# EAGLE design HIVE_dev_sc (EAGLE 9.5.1)

## Sheet 1 of 3
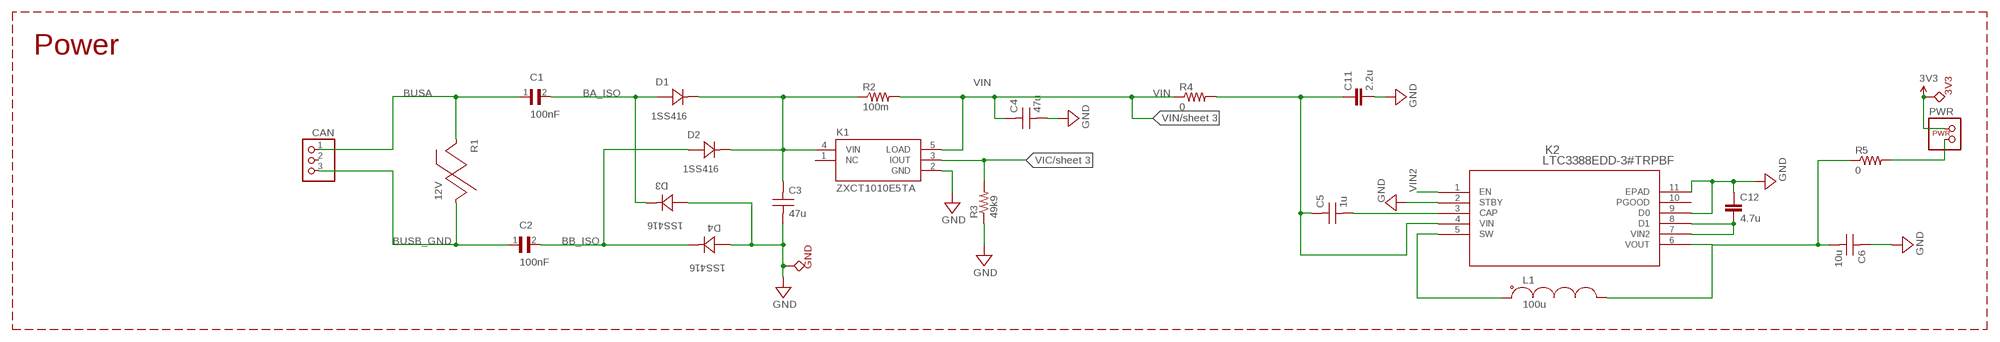
[diagram p0: schematic, sheet 1]

### Parts
3V3  TPTP5001  [TP5000OR5001]
C1  100nF  UMK105BJ104KV-F  [CAPC1005X55N]
C2  100nF  UMK105BJ104KV-F  [CAPC1005X55N]
C3  47u  C_NPOL_0603  [C0603]
C4  47u  C_NPOL_0603  [C0603]
C5  1u  C_NPOL_0201  [C0201]
C6  10u  C_NPOL_0603  [C0603]
C11  2.2u  C_2.2UF_25V_20%_0402  [0402]
C12  4.7u  C_4.7UF_6.3V_20%_0402  [0402]
CAN  PINHD-1X3  [1X03]
D1  1SS416  [SOD-923_TOS]
D2  1SS416  [SOD-923_TOS]
D3  1SS416  [SOD-923_TOS]
D4  1SS416  [SOD-923_TOS]
GND  TPTP5001  [TP5000OR5001]
K1  ZXCT1010E5TA  [SOT25]
K2  LTC3388EDD-3#TRPBF  [DFN-10_DD]
L1  100u  INDUCTOR_LPS4414  [LPS4414]
PWR  POWERJUMP  [1X04]
R1  12V  CG0603MLC  [CG0603MLC]
R2  100m  R_0201  [R0201]
R3  49k9  R_49.9K_1/20W_1%_0201  [0201]
R4  0  R_0201  [R0201]
R5  0  R_0201  [R0201]

### Nets
3V3: 3V3.P$1 PWR.1 PWR.2 ; also sheet 2,3
BA_ISO: C1.2 D1.2(ANODE) D3.1(CATHODE)
BB_ISO: C2.2 D2.2(ANODE) D4.1(CATHODE)
BUSA: C1.1 CAN.1 R1.1 ; also sheet 2
BUSB_GND: C2.1 CAN.3 R1.2 ; also sheet 2
GND: C3.1 C4.1 C6.2 C11.2 C12.1 D3.2(ANODE) D4.2(ANODE) GND.P$1 K1.2(GND) K2.2(STBY) K2.9(D0) K2.11(EPAD) R3.1 ; also sheet 2,3
N$1: C5.2 C11.1 K2.4(VIN) R4.2
N$4: C12.2 K2.7(VIN2) K2.8(D1)
N$5: C6.1 K2.6(VOUT) L1.P$2 R5.1
N$6: C5.1 K2.3(CAP)
N$7: C3.2 D1.1(CATHODE) D2.1(CATHODE) K1.4(VIN) R2.1
N$8: K2.5(SW) L1.P$1
N$46: PWR.3 PWR.4 R5.2
VIC: K1.3(IOUT) R3.2 ; also sheet 3
VIN: C4.2 K1.5(LOAD) R2.2 R4.1 ; also sheet 3
VIN2: K2.1(EN) ; also sheet 2
Unconnected: CAN.2 K1.1(NC) K2.10(PGOOD)

### Notes on the sheet
- Power

## Sheet 2 of 3
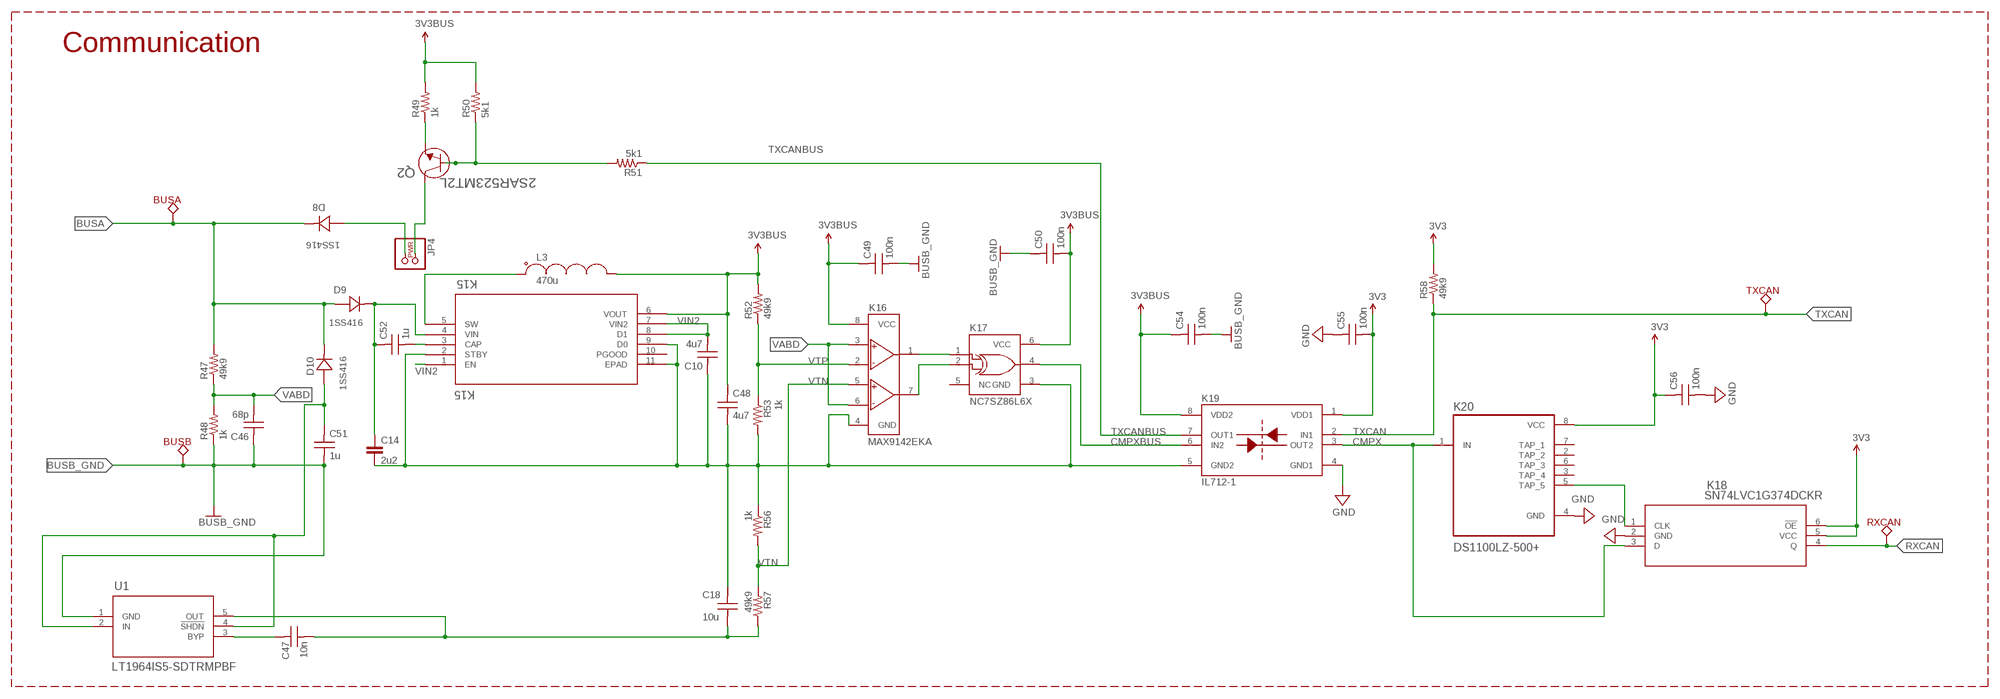
[diagram p1: schematic, sheet 2]

### Parts
BUSA  TPTP5001  [TP5000OR5001]
BUSB  TPTP5001  [TP5000OR5001]
C10  4u7  C_NPOL_0402  [C0402]
C14  2u2  C_2.2UF_25V_20%_0402  [0402]
C18  10u  C_NPOL_0201  [C0201]
C46  68p  C_NPOL_0201  [C0201]
C47  10n  C_NPOL_0201  [C0201]
C48  4u7  C_NPOL_0402  [C0402]
C49  100n  C_NPOL_0201  [C0201]
C50  100n  C_NPOL_0201  [C0201]
C51  1u  C_NPOL_0201  [C0201]
C52  1u  C_NPOL_0201  [C0201]
C54  100n  C_NPOL_0201  [C0201]
C55  100n  C_NPOL_0201  [C0201]
C56  100n  C_NPOL_0201  [C0201]
D8  1SS416  [SOD-923_TOS]
D9  1SS416  [SOD-923_TOS]
D10  1SS416  [SOD-923_TOS]
JP4  POWERJUMP  [1X04]
K15  K15  LTC3388EDD-3#TRPBF  [DFN-10_DD]
K16  MAX9142EKA  [SOT23-8]
K17  NC7SZ86L6X  [MAC06A]
K18  SN74LVC1G374DCKR  [DCK6]
K19  IL712-1  [MSOP-8]
K20  DS1100LZ-500+  [SOIC127P600X175-8N]
L3  470u  INDUCTOR_CB2518  [CB2518]
Q2  2SAR523MT2L  [TRANS_2SAR522M_ROM]
R47  49k9  R_49.9K_1/20W_1%_0201  [0201]
R48  1k  R_1K_1/20W_1%_0201  [0201]
R49  1k  R_1K_1/20W_1%_0201  [0201]
R50  5k1  R_5.1K_1/20W_5%_0201  [0201]
R51  5k1  R_5.1K_1/20W_5%_0201  [0201]
R52  49k9  R_49.9K_1/20W_1%_0201  [0201]
R53  1k  R_1K_1/20W_1%_0201  [0201]
R56  1k  R_1K_1/20W_1%_0201  [0201]
R57  49k9  R_49.9K_1/20W_1%_0201  [0201]
R58  49k9  R_49.9K_1/20W_1%_0201  [0201]
RXCAN  TPTP5001  [TP5000OR5001]
TXCAN  TPTP5001  [TP5000OR5001]
U1  LT1964IS5-SDTRMPBF  [TSOT23-5_S5_ADI]

### Nets
3V3: C55.1 C56.2 K18.5(VCC) K18.6(!OE) K19.1(VDD1) K20.8(VCC) R58.2 ; also sheet 1,3
3V3BUS: C48.2 C49.2 C50.1 C54.2 K15.6(VOUT) K16.8(VCC) K17.6(VCC) K19.8(VDD2) L3.2 R49.2 R50.2 R52.2
3V3BUS2: JP4.1 JP4.2 Q2.1(COLLECTOR)
BUSA: BUSA.P$1 D8.1(CATHODE) D9.2(ANODE) D10.1(CATHODE) R47.2 ; also sheet 1
BUSB_GND: BUSB.P$1 C46.2 C49.1 C50.2 C51.1 C54.1 R48.1 U1.1(GND) ; also sheet 1
CMPX: K18.3(D) K19.3(OUT2) K20.1(IN)
CMPXBUS: K17.4(Y) K19.6(IN2)
GND: C55.2 C56.1 K18.2(GND) K19.4(GND1) K20.4(GND) ; also sheet 1,3
N$9: K15.5(SW) L3.1
N$10: C10.2 C14.2 C18.2 C48.1 K15.2(STBY) K15.9(D0) K15.11(EPAD) K16.4(GND) K17.3(GND) K19.5(GND2) R53.2 R56.1
N$11: C52.1 K15.3(CAP)
N$12: K18.1(CLK) K20.5(TAP_5)
N$13: Q2.3(EMITTER) R49.1
N$90: C47.2 U1.3(BYP)
N$96: C14.1 C52.2 D9.1(CATHODE) K15.4(VIN)
N$128: C51.2 D10.2(ANODE) U1.2(IN) U1.4(!SHDN)
N$138: C18.1 C47.1 R57.1 U1.5(OUT)
N$161: Q2.2(BASE) R50.1 R51.2
N$163: K16.1(OUT1) K17.1(A)
N$164: K16.7(OUT2) K17.2(B)
N$168: D8.2(ANODE) JP4.3 JP4.4
RXCAN: K18.4(Q) RXCAN.P$1 ; also sheet 3
TXCAN: K19.2(IN1) R58.1 TXCAN.P$1 ; also sheet 3
TXCANBUS: K19.7(OUT1) R51.1
VABD: C46.1 K16.3(+IN1) K16.6(-IN2) R47.1 R48.2
VIN2: C10.1 K15.1(EN) K15.7(VIN2) K15.8(D1) ; also sheet 1
VTN: K16.5(+IN2) R56.2 R57.2
VTP: K16.2(-IN1) R52.1 R53.1
Unconnected: K15.10(PGOOD) K17.5(NC) K20.2(TAP_2) K20.3(TAP_4) K20.6(TAP_3) K20.7(TAP_1)

### Notes on the sheet
- Communication

## Sheet 3 of 3
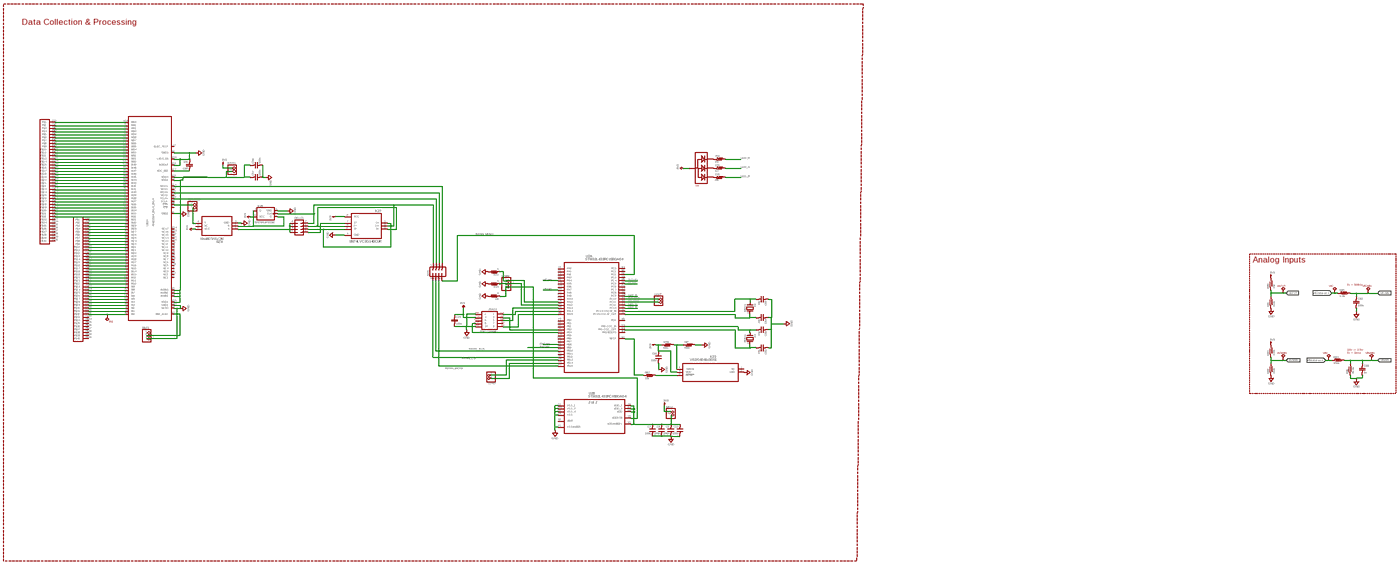
[diagram p2: schematic, sheet 3, overview]
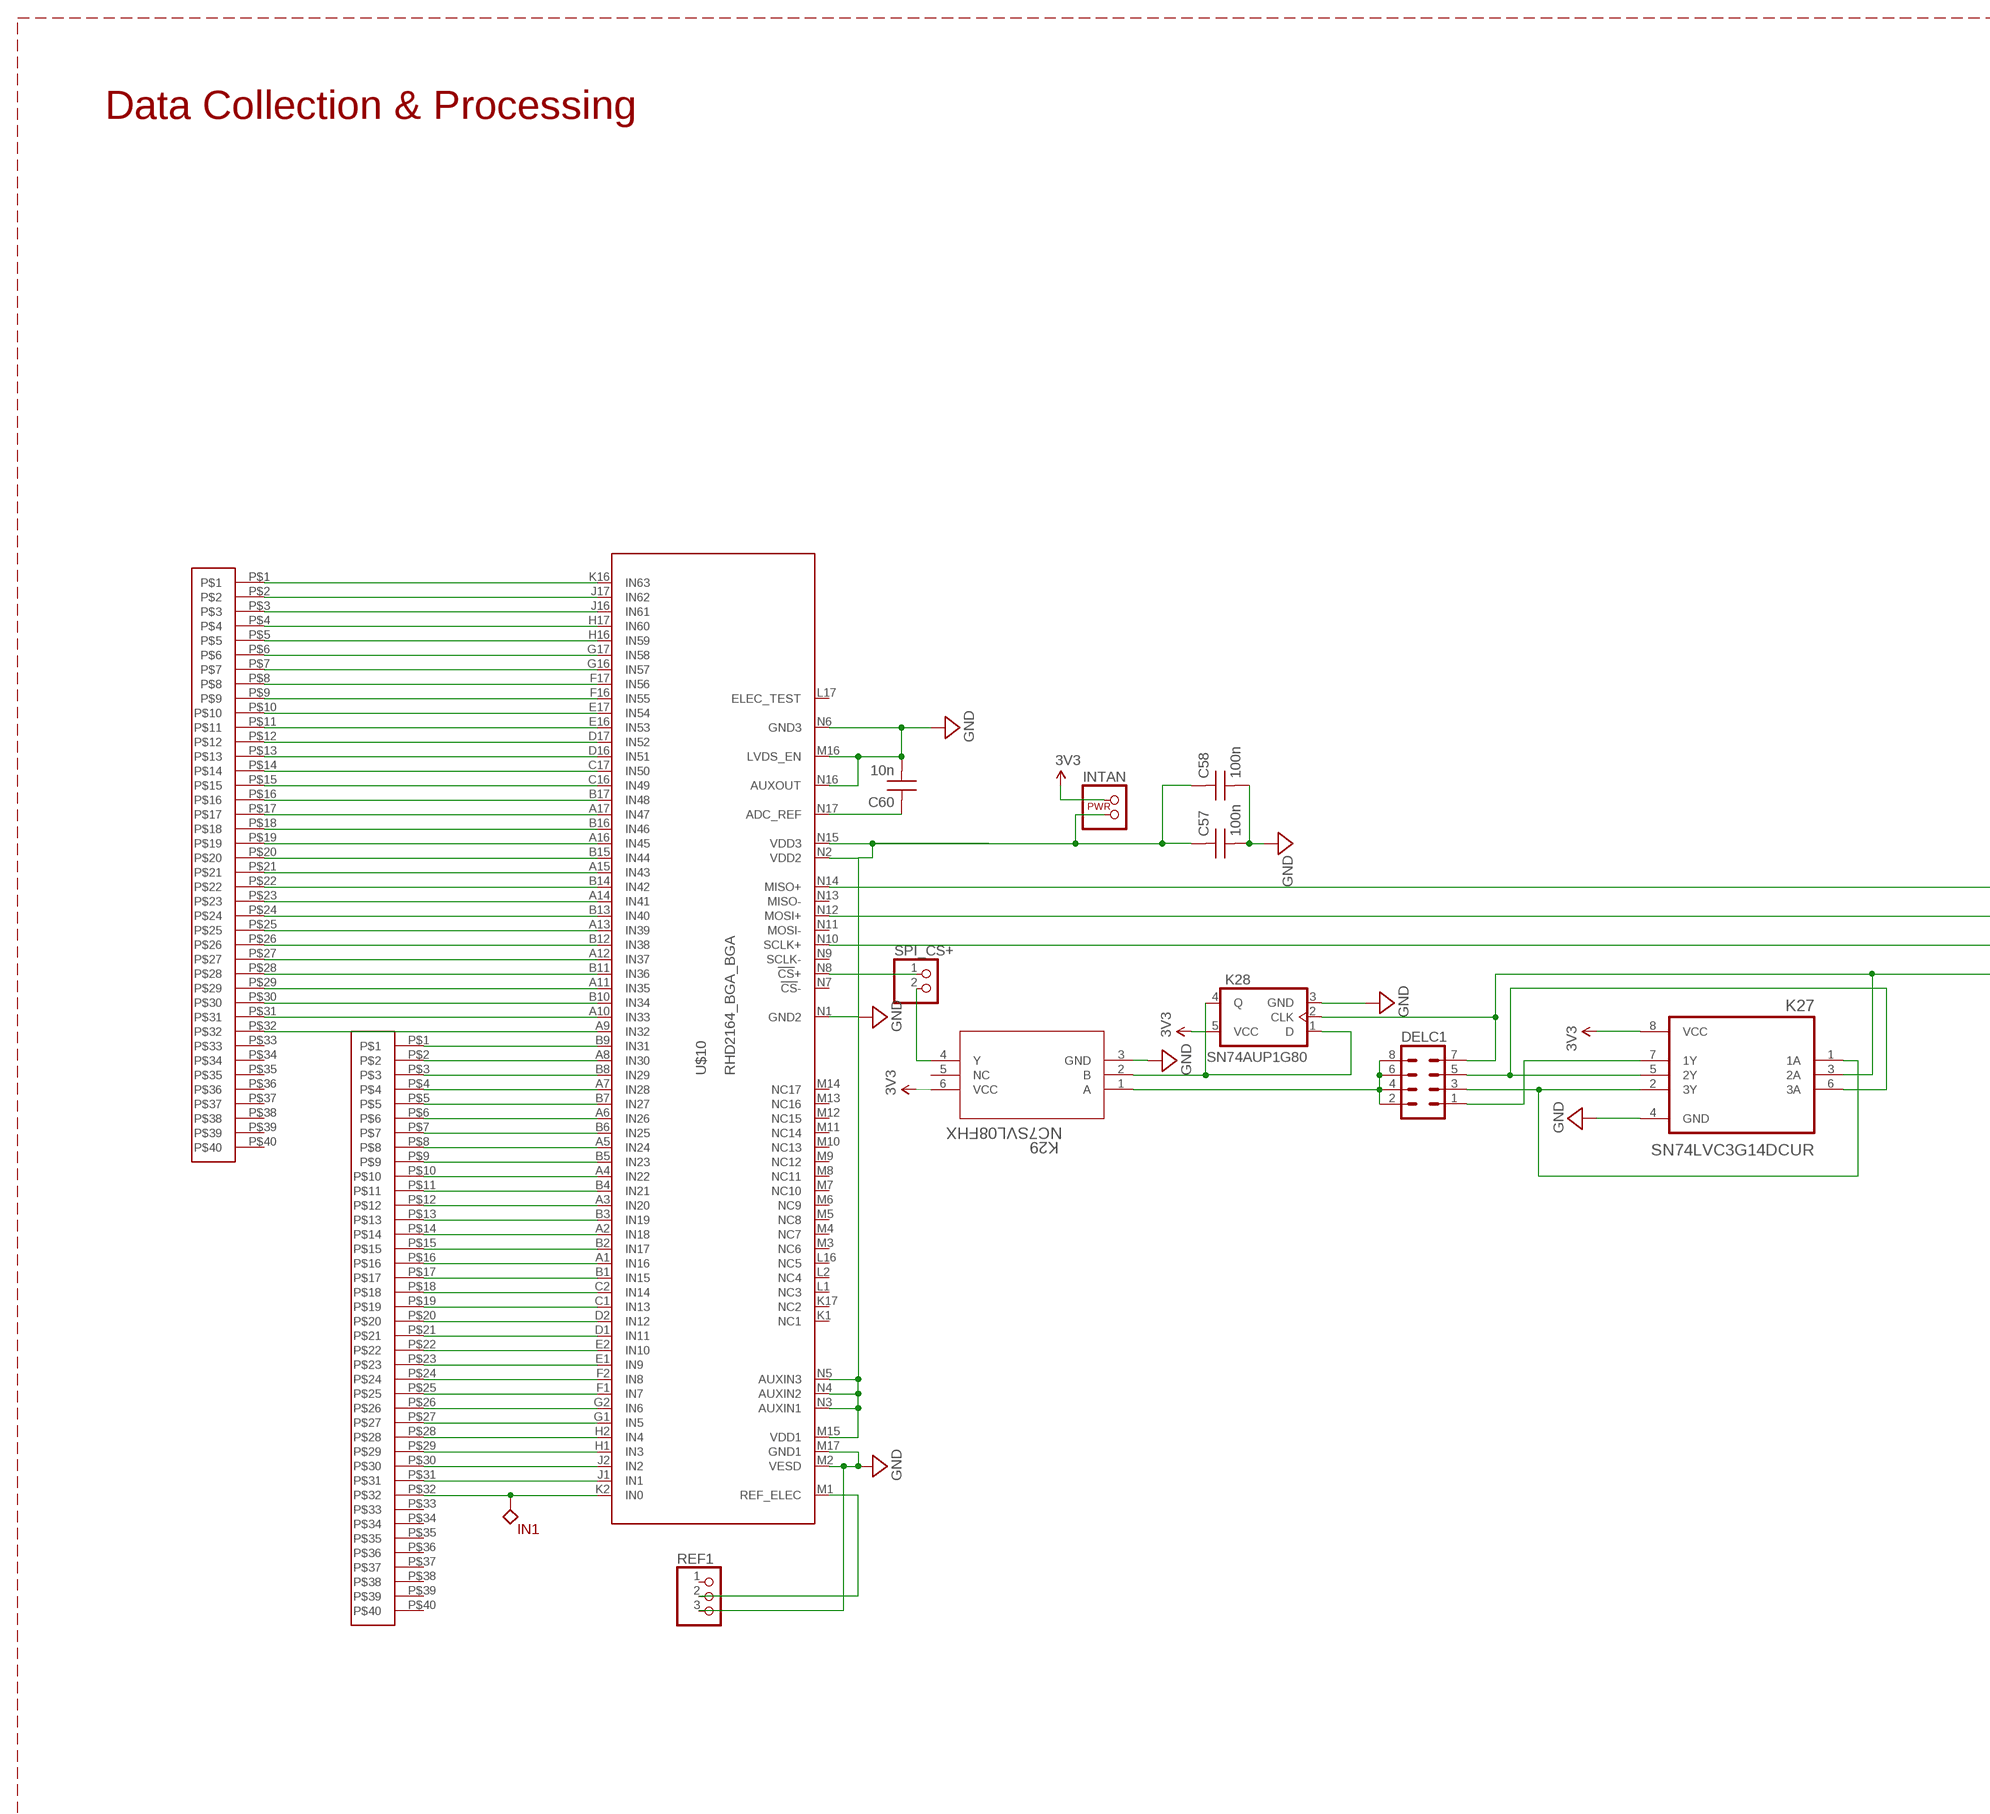
[diagram p3: schematic, sheet 3, part 1 of 5]
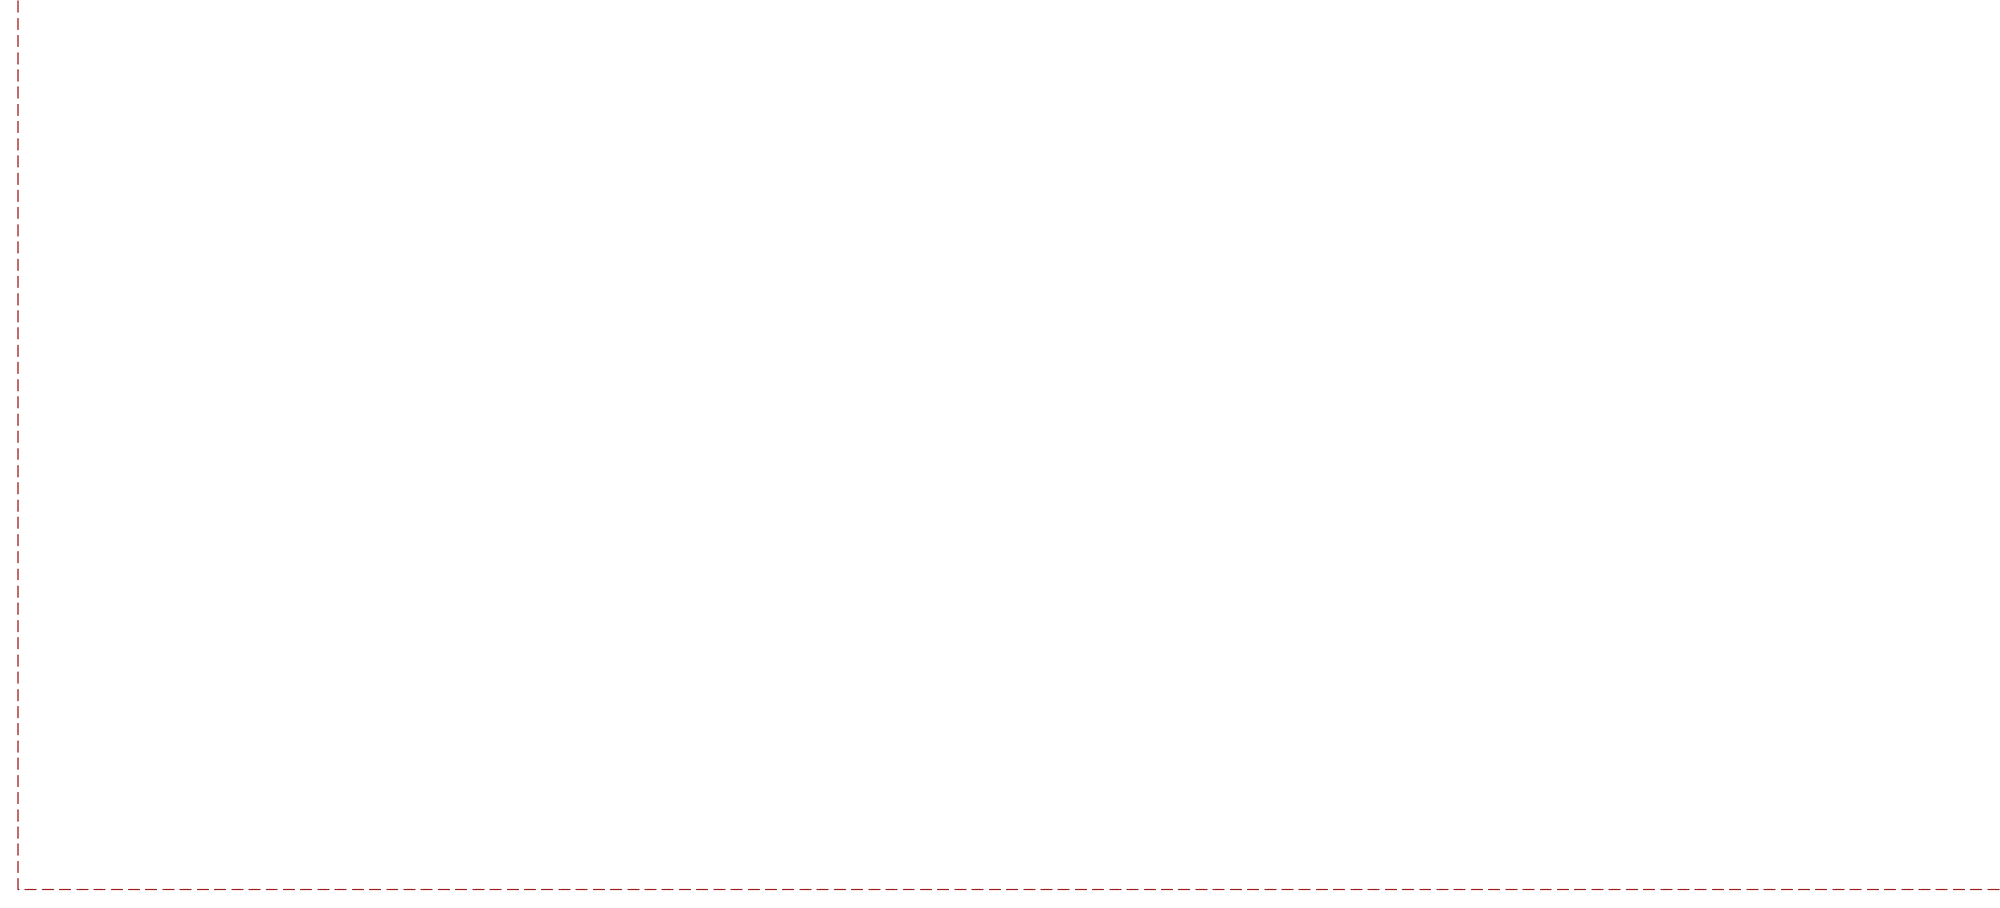
[diagram p4: schematic, sheet 3, part 2 of 5]
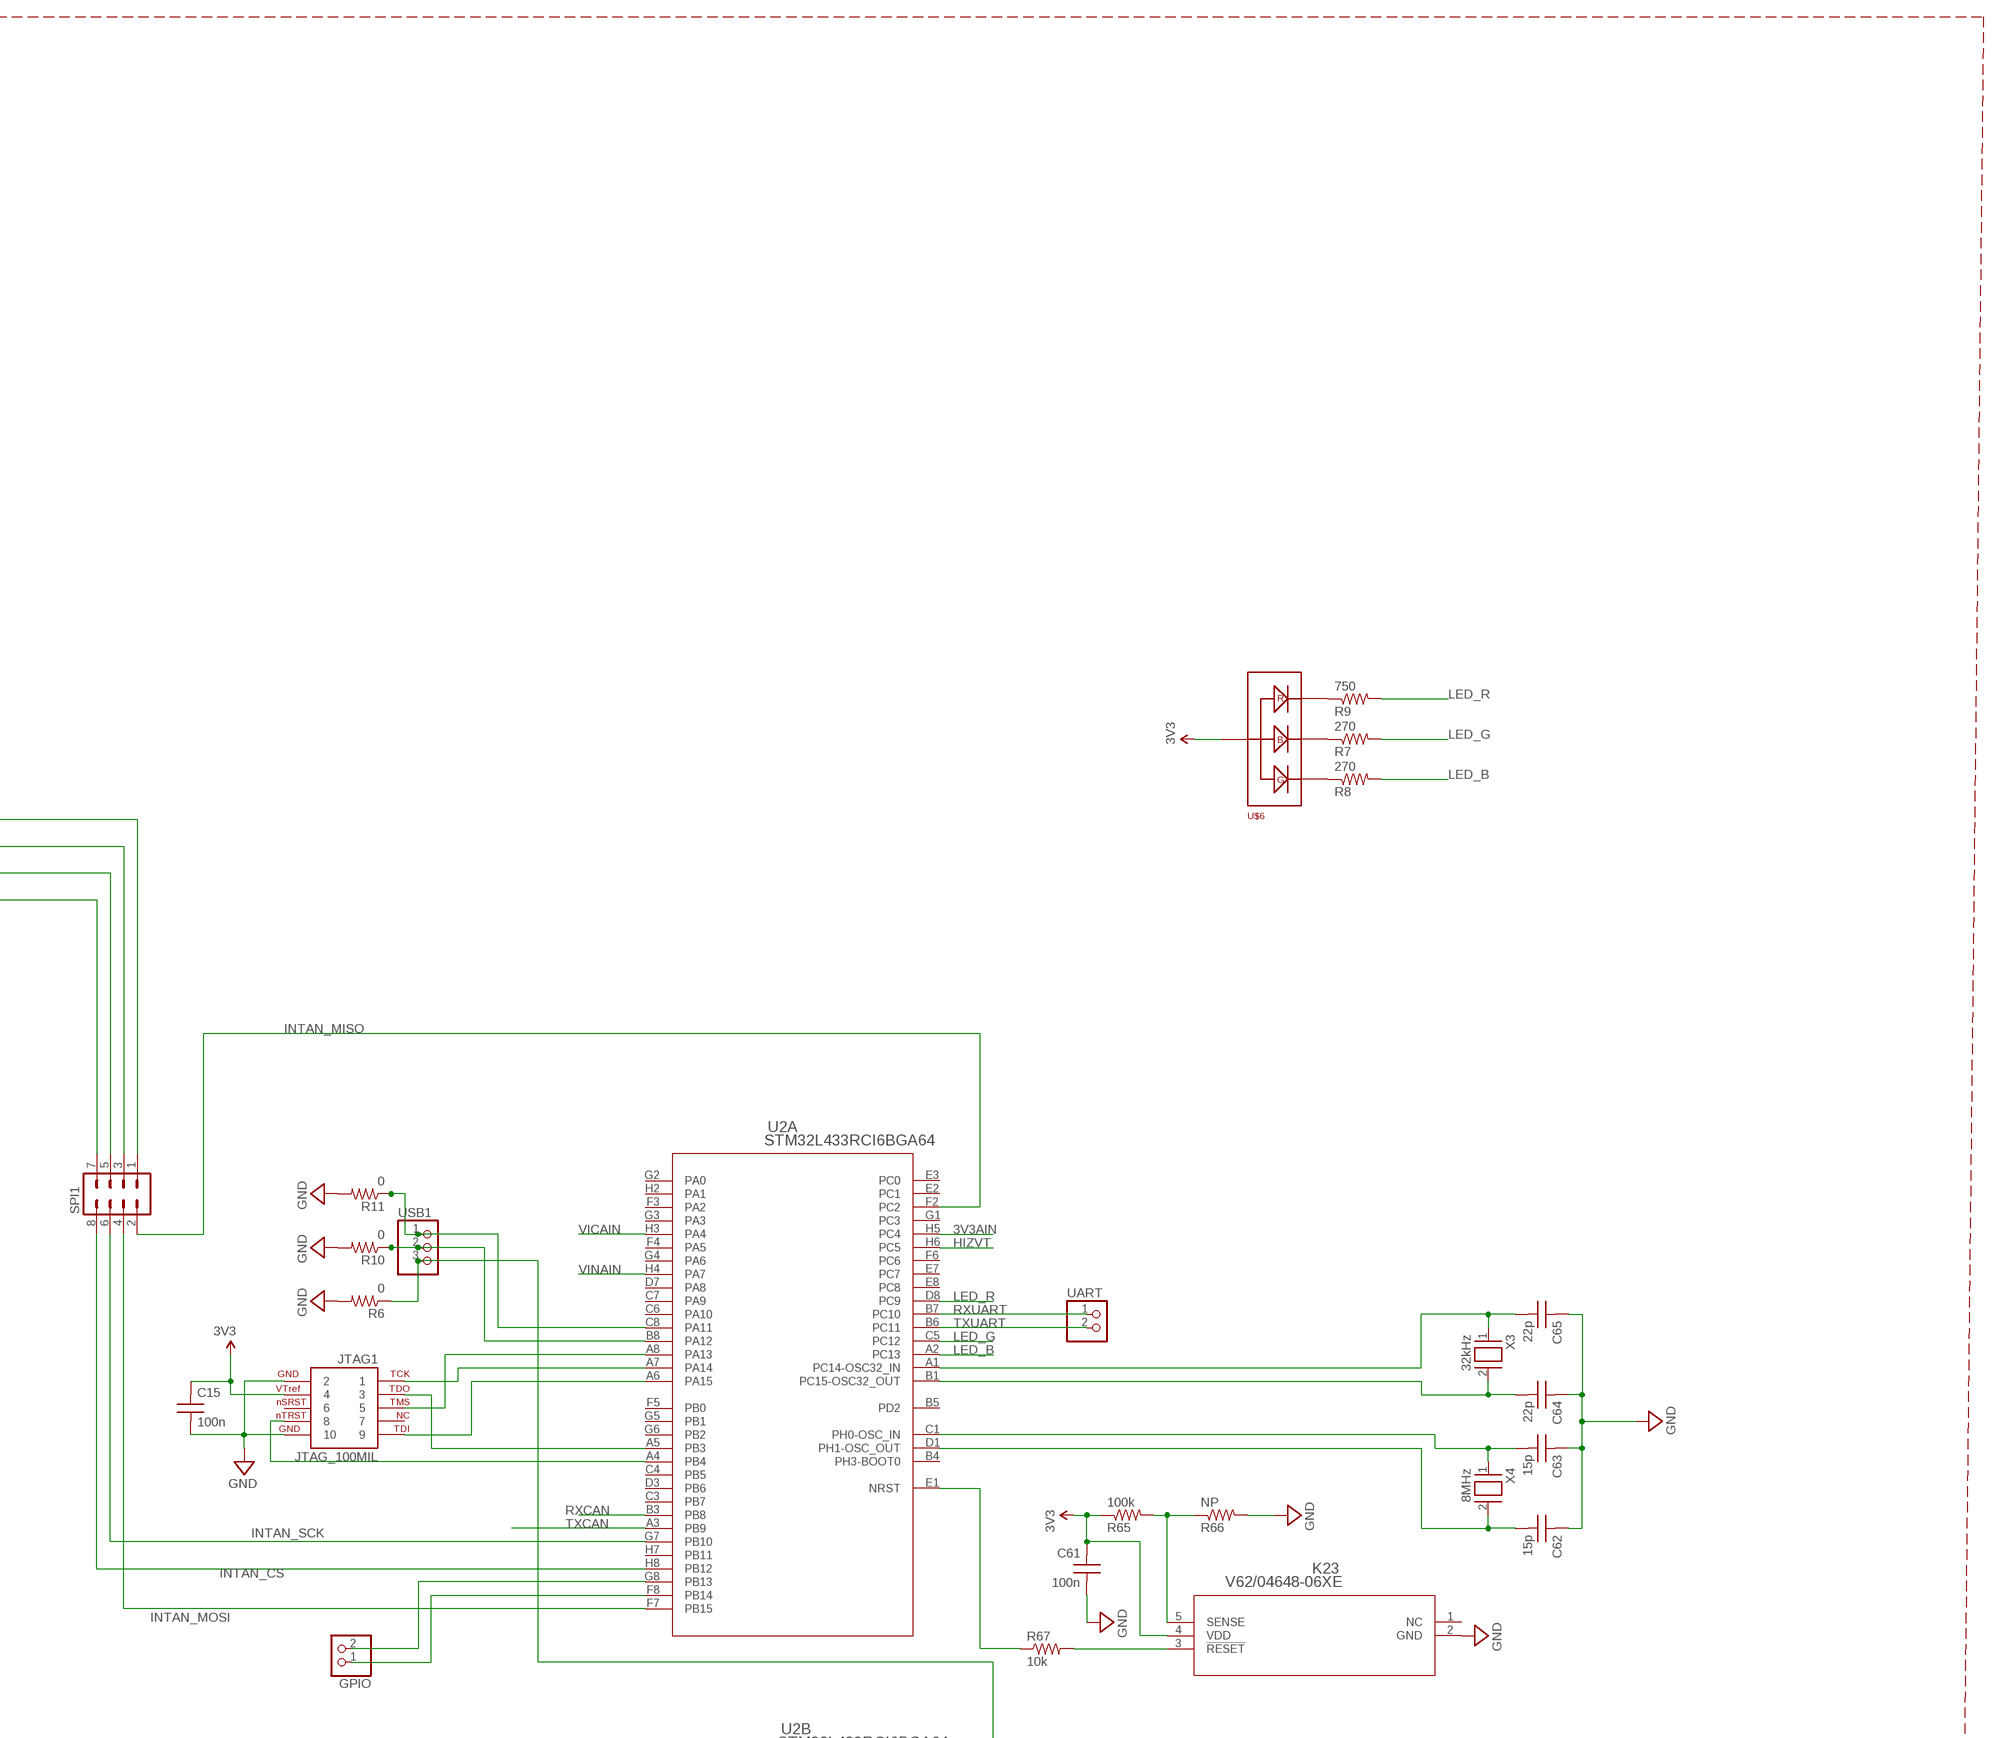
[diagram p5: schematic, sheet 3, part 3 of 5]
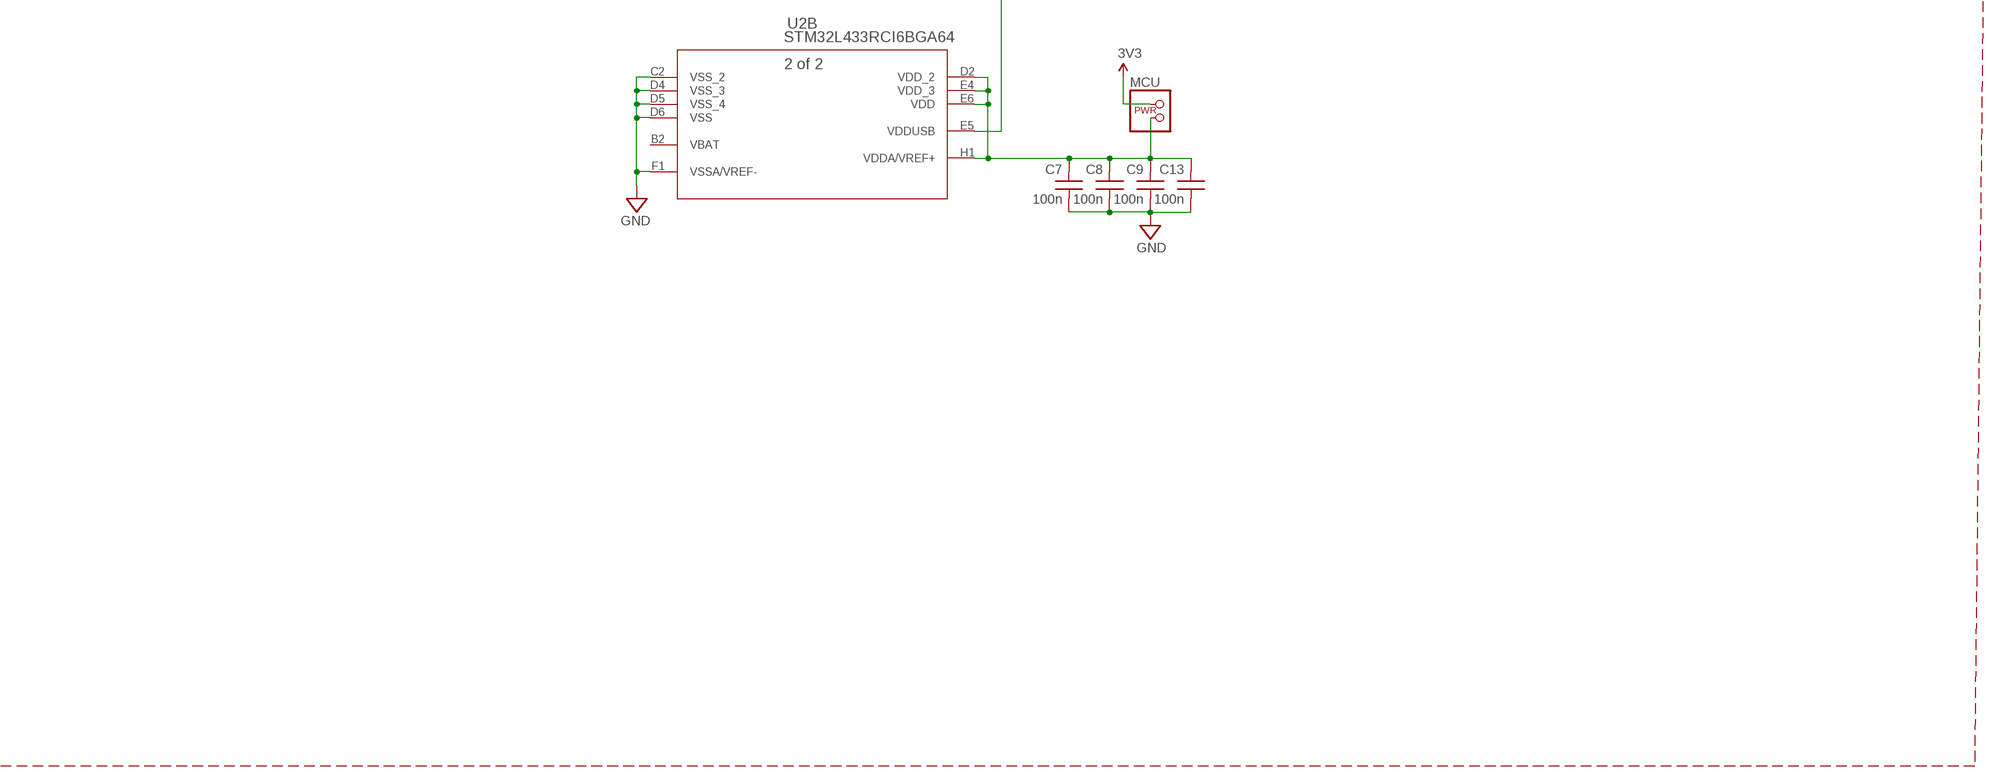
[diagram p6: schematic, sheet 3, part 4 of 5]
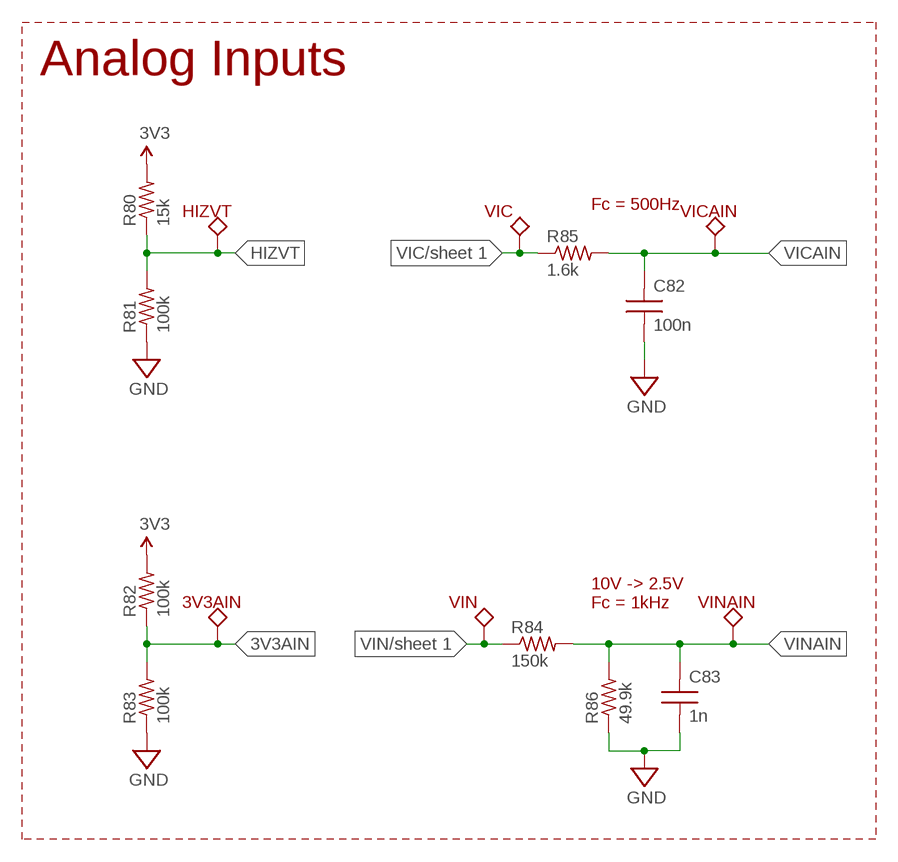
[diagram p7: schematic, sheet 3, part 5 of 5]

### Parts
3V3AIN  TPTP5001  [TP5000OR5001]
C7  100n  C_NPOL_0201  [C0201]
C8  100n  C_NPOL_0201  [C0201]
C9  100n  C_NPOL_0201  [C0201]
C13  100n  C_NPOL_0201  [C0201]
C15  100n  C_NPOL_0201  [C0201]
C57  100n  C_NPOL_0201  [C0201]
C58  100n  C_NPOL_0201  [C0201]
C60  10n  C_NPOL_0201  [C0201]
C61  100n  C_NPOL_0201  [C0201]
C62  15p  C_NPOL_0402  [C0402]
C63  15p  C_NPOL_0402  [C0402]
C64  22p  C_NPOL_0402  [C0402]
C65  22p  C_NPOL_0402  [C0402]
C82  100n  C_NPOL_0201  [C0201]
C83  1n  C_NPOL_0201  [C0201]
DELC1  MA04-2  [MA04-2]
GPIO  PINHD-1X2  [1X02]
HIZVT  TPTP5001  [TP5000OR5001]
IN1  TPTP5001  [TP5000OR5001]
INTAN  POWERJUMP  [1X04]
JTAG1  JTAG_100MIL  [JTAG-10]
K23  V62/04648-06XE  [DCK5]
K27  SN74LVC3G14DCUR  [SOP50P310X90-8N]
K28  SN74AUP1G80  [SOT23-5]
K29  NC7SVL08FHX  [MICROPAK2-6_1X1_ONS]
MCU  POWERJUMP  [1X04]
R6  0  R_0201  [R0201]
R7  270  R_0201  [R0201]
R8  270  R_0201  [R0201]
R9  750  R_0201  [R0201]
R10  0  R_0201  [R0201]
R11  0  R_0201  [R0201]
R65  100k  R_0201  [R0201]
R66  NP  R_0201  [R0201]
R67  10k  R_0201  [R0201]
R80  15k  R_0201  [R0201]
R81  100k  R_0201  [R0201]
R82  100k  R_0201  [R0201]
R83  100k  R_0201  [R0201]
R84  150k  R_0201  [R0201]
R85  1.6k  R_0201  [R0201]
R86  49.9k  R_49.9K_1/20W_1%_0201  [0201]
REF1  PINHD-1X3  [1X03]
SPI1  MA04-2  [MA04-2]
SPI_CS+  PINHD-1X2  [1X02]
U2  STM32L433RCI6BGA64  [BGA64N50P8X8_500X500X60N]
U$3  40-PIN-SAMTEC  [SAMTECSFH120-01-X-D-SM-LC]
U$4  40-PIN-SAMTEC  [SAMTECSFH120-01-X-D-SM-LC]
U$6  WINI_KINGBRIGHT_APHF1608LSEEQBDZGKC  [WINI_4-SMD]
U$10  RHD2164_BGA_BGA  [BGA104_9X7]
UART  PINHD-1X2  [1X02]
USB1  PINHD-1X3  [1X03]
VIC  TPTP5001  [TP5000OR5001]
VICAIN  TPTP5001  [TP5000OR5001]
VIN  TPTP5001  [TP5000OR5001]
VINAIN  TPTP5001  [TP5000OR5001]
X3  32kHz  CRYSTAL_ABS07  [ABS07]
X4  8MHz  CRYSTAL_NX5032GA  [NX5032GA]

### Nets
3V3: C15.2 C61.2 INTAN.1 INTAN.2 JTAG1.4 K23.4(VDD) K27.8(VCC) K28.5(VCC) MCU.1 MCU.2 R65.1 R80.2 R82.2 U$6.V+ ; also sheet 1,2
3V3AIN: 3V3AIN.P$1 R82.1 R83.2 U2.H5(A:PC4)
GND: C7.1 C8.1 C9.1 C13.1 C15.1 C57.1 C58.1 C60.1 C61.1 C62.2 C63.2 C64.2 C65.2 C82.1 C83.1 JTAG1.2 JTAG1.10 K23.2(GND) K27.4(GND) K28.3(GND) K29.3(GND) R6.2 R10.2 R11.2 R66.2 R81.1 R83.1 R86.1 REF1.3 U2.C2(B:VSS_2) U2.D4(B:VSS_3) U2.D5(B:VSS_4) U2.D6(B:VSS) U2.F1(B:VSSA/VREF-) U$10.M2(VESD) U$10.M16(LVDS_EN) U$10.M17(GND1) U$10.N1(GND2) U$10.N6(GND3) U$10.N16(AUXOUT) ; also sheet 1,2
HIZVT: HIZVT.P$1 R80.1 R81.2 U2.H6(A:PC5)
INTAN_CS: SPI1.8 U2.H8(A:PB12)
INTAN_MISO: SPI1.2 U2.F2(A:PC2)
INTAN_MOSI: SPI1.4 U2.F7(A:PB15)
INTAN_SCK: SPI1.6 U2.G7(A:PB10)
LED_B: R8.2 U2.A2(A:PC13)
LED_G: R7.2 U2.C5(A:PC12)
LED_R: R9.2 U2.D8(A:PC9)
N$2: R67.1 U2.E1(A:NRST)
N$3: IN1.P$1 U$4.P$32 U$10.K2(IN0)
N$14: C60.2 U$10.N17(ADC_REF)
N$15: SPI_CS+.1 U$10.N8(!CS!+)
N$16: C57.2 C58.2 INTAN.3 INTAN.4 U$10.M15(VDD1) U$10.N2(VDD2) U$10.N3(AUXIN1) U$10.N4(AUXIN2) U$10.N5(AUXIN3) U$10.N15(VDD3)
N$17: DELC1.7 K27.3(2A) K28.2(CLK) SPI1.7
N$18: DELC1.2 DELC1.4 DELC1.6 DELC1.8 K29.1(A)
N$19: DELC1.5 K27.5(2Y) K27.6(3A)
N$20: SPI1.5 U$10.N10(SCLK+)
N$21: DELC1.3 K27.1(1A) K27.2(3Y)
N$22: DELC1.1 K27.7(1Y)
N$23: SPI1.1 U$10.N14(MISO+)
N$24: SPI1.3 U$10.N12(MOSI+)
N$25: K23.3(!RESET) R67.2
N$26: U$4.P$31 U$10.J1(IN1)
N$27: U$4.P$30 U$10.J2(IN2)
N$28: U$4.P$29 U$10.H1(IN3)
N$29: U$4.P$28 U$10.H2(IN4)
N$30: U$4.P$27 U$10.G1(IN5)
N$31: U$4.P$26 U$10.G2(IN6)
N$32: U$4.P$25 U$10.F1(IN7)
N$33: U$4.P$24 U$10.F2(IN8)
N$34: U$4.P$23 U$10.E1(IN9)
N$35: U$4.P$22 U$10.E2(IN10)
N$36: U$4.P$21 U$10.D1(IN11)
N$37: U$4.P$20 U$10.D2(IN12)
N$38: U$4.P$19 U$10.C1(IN13)
N$39: U$4.P$18 U$10.C2(IN14)
N$40: U$4.P$17 U$10.B1(IN15)
N$41: U$4.P$16 U$10.A1(IN16)
N$42: U$4.P$15 U$10.B2(IN17)
N$43: U$4.P$14 U$10.A2(IN18)
N$44: U$4.P$13 U$10.B3(IN19)
N$45: U$4.P$12 U$10.A3(IN20)
N$47: U$4.P$11 U$10.B4(IN21)
N$48: U$4.P$10 U$10.A4(IN22)
N$49: U$4.P$9 U$10.B5(IN23)
N$50: U$4.P$8 U$10.A5(IN24)
N$51: U$4.P$7 U$10.B6(IN25)
N$52: U$4.P$6 U$10.A6(IN26)
N$53: U$4.P$5 U$10.B7(IN27)
N$54: U$4.P$4 U$10.A7(IN28)
N$55: U$4.P$3 U$10.B8(IN29)
N$56: U$4.P$2 U$10.A8(IN30)
N$57: U$4.P$1 U$10.B9(IN31)
N$58: U$3.P$32 U$10.A9(IN32)
N$59: U$3.P$31 U$10.A10(IN33)
N$60: U$3.P$30 U$10.B10(IN34)
N$61: U$3.P$29 U$10.A11(IN35)
N$62: U$3.P$28 U$10.B11(IN36)
N$63: U$3.P$27 U$10.A12(IN37)
N$64: U$3.P$26 U$10.B12(IN38)
N$65: U$3.P$25 U$10.A13(IN39)
N$66: U$3.P$24 U$10.B13(IN40)
N$67: U$3.P$23 U$10.A14(IN41)
N$68: U$3.P$22 U$10.B14(IN42)
N$69: U$3.P$21 U$10.A15(IN43)
N$70: U$3.P$20 U$10.B15(IN44)
N$71: U$3.P$19 U$10.A16(IN45)
N$72: U$3.P$18 U$10.B16(IN46)
N$73: U$3.P$17 U$10.A17(IN47)
N$74: U$3.P$16 U$10.B17(IN48)
N$75: U$3.P$15 U$10.C16(IN49)
N$76: U$3.P$14 U$10.C17(IN50)
N$77: U$3.P$13 U$10.D16(IN51)
N$78: U$3.P$12 U$10.D17(IN52)
N$79: U$3.P$11 U$10.E16(IN53)
N$80: U$3.P$10 U$10.E17(IN54)
N$81: U$3.P$9 U$10.F16(IN55)
N$82: U$3.P$8 U$10.F17(IN56)
N$83: U$3.P$7 U$10.G16(IN57)
N$84: U$3.P$6 U$10.G17(IN58)
N$85: U$3.P$5 U$10.H16(IN59)
N$86: U$3.P$4 U$10.H17(IN60)
N$87: U$3.P$3 U$10.J16(IN61)
N$88: U$3.P$2 U$10.J17(IN62)
N$89: U$3.P$1 U$10.K16(IN63)
N$91: JTAG1.3 U2.A5(A:PB3)
N$92: JTAG1.9 U2.A6(A:PA15)
N$93: JTAG1.1 U2.A7(A:PA14)
N$94: JTAG1.8 U2.A4(A:PB4)
N$95: JTAG1.5 U2.A8(A:PA13)
N$97: REF1.2 U$10.M1(REF_ELEC)
N$98: R7.1 U$6.B
N$99: R10.1 U2.B8(A:PA12) USB1.2
N$100: R6.1 U2.E5(B:VDDUSB) USB1.3
N$101: R11.1 U2.C8(A:PA11) USB1.1
N$102: R8.1 U$6.G
N$103: R9.1 U$6.R
N$104: GPIO.2 U2.G8(A:PB13)
N$105: GPIO.1 U2.F8(A:PB14)
N$106: K29.4(Y) SPI_CS+.2
N$139: C65.1 U2.A1(A:PC14-OSC32_IN) X3.1
N$143: C7.2 C8.2 C9.2 C13.2 MCU.3 MCU.4 U2.D2(B:VDD_2) U2.E4(B:VDD_3) U2.E6(B:VDD) U2.H1(B:VDDA/VREF+)
N$175: K23.5(SENSE) R65.2 R66.1
N$177: C63.1 U2.C1(A:PH0-OSC_IN) X4.1
N$178: C64.1 U2.B1(A:PC15-OSC32_OUT) X3.2
N$180: C62.1 U2.D1(A:PH1-OSC_OUT) X4.2
N$208: K28.1(D) K28.4(Q) K29.2(B)
RXCAN: U2.B3(A:PB8) ; also sheet 2
RXUART: U2.B7(A:PC10) UART.1
TXCAN: U2.A3(A:PB9) ; also sheet 2
TXUART: U2.B6(A:PC11) UART.2
VIC: R85.1 VIC.P$1 ; also sheet 1
VICAIN: C82.2 R85.2 U2.H3(A:PA4) VICAIN.P$1
VIN: R84.1 VIN.P$1 ; also sheet 1
VINAIN: C83.2 R84.2 R86.2 U2.H4(A:PA7) VINAIN.P$1
Unconnected: JTAG1.6 JTAG1.7 K23.1(NC) K29.5(NC) REF1.1 U2.B4(A:PH3-BOOT0) U2.B5(A:PD2) U2.C3(A:PB7) U2.C4(A:PB5) U2.C6(A:PA10) U2.C7(A:PA9) U2.D3(A:PB6) U2.D7(A:PA8) U2.E2(A:PC1) U2.E3(A:PC0) U2.E7(A:PC7) U2.E8(A:PC8) U2.F3(A:PA2) U2.F4(A:PA5) U2.F5(A:PB0) U2.F6(A:PC6) U2.G1(A:PC3) U2.G2(A:PA0) U2.G3(A:PA3) U2.G4(A:PA6) U2.G5(A:PB1) U2.G6(A:PB2) U2.H2(A:PA1) U2.H7(A:PB11) U$3.P$33 U$3.P$34 U$3.P$35 U$3.P$36 U$3.P$37 U$3.P$38 U$3.P$39 U$3.P$40 U$4.P$33 U$4.P$34 U$4.P$35 U$4.P$36 U$4.P$37 U$4.P$38 U$4.P$39 U$4.P$40 U$10.K1(NC1) U$10.K17(NC2) U$10.L1(NC3) U$10.L2(NC4) U$10.L16(NC5) U$10.L17(ELEC_TEST) U$10.M3(NC6) U$10.M4(NC7) U$10.M5(NC8) U$10.M6(NC9) U$10.M7(NC10) U$10.M8(NC11) U$10.M9(NC12) U$10.M10(NC13) U$10.M11(NC14) U$10.M12(NC15) U$10.M13(NC16) U$10.M14(NC17) U$10.N7(!CS!-) U$10.N9(SCLK-) U$10.N11(MOSI-) U$10.N13(MISO-)

### Notes on the sheet
- Data Collection & Processing
- Analog Inputs
- Fc = 500Hz
- 10V -> 2.5V
  Fc = 1kHz

## Power pins joined to a net without a drawn wire
VBAT: U2.B2(B:VBAT)
VCC: K29.6(VCC)

## Library data of the parts
3V3 3V3AIN BUSA BUSB GND HIZVT IN1 RXCAN TXCAN VIC VICAIN VIN VINAIN = cederna:TP
C1 C2 = UMK105BJ104KV-F:UMK105BJ104KV-F: Cap Ceramic 0.1uF 50V X5R 10% Pad SMD 0402 85C T/R; DESCRIPTION: 0.1 µF ±10% 50V Ceramic Capacitor X5R 0402 (1005 Metric); DIGI-KEY_PART_NUMBER: 587-3499-2-ND; MF: Taiyo Yuden; MP: UMK105BJ104KV-F; PACKAGE: 1005 Taiyo Yuden; PURCHASE-URL: https://pricing.snapeda.com/search/part/UMK105BJ104KV-F/?ref=eda
C3-C10 C13 C15 C18 C46-C52 C54-C58 C60-C65 C82 C83 = Neilsen:C_NPOL_: Generic non-polarized capacitor
C11 C14 = WiSSCI_passives:C: Capacitor; DIGIKEY_PN: 490-13235-1-ND; MFR: Murata Electronics; MFR_PN: Murata Electronics
C12 = WiSSCI_passives:C: Capacitor; DIGIKEY_PN: 490-GRM155C80J475MEAAJCT-ND; MFR: Murata Electronics; MFR_PN: GRM155C80J475MEAAJ
CAN REF1 USB1 = Neilsen:PINHD-1X3: PIN HEADER
D1-D4 D8-D10 = 1SS416L3M:1SS416; COPYRIGHT: Copyright (C) 2022 Ultra Librarian. All rights reserved.; DIGI-KEY_PART_NUMBER_1: 1SS416L3M-ND; DIGI-KEY_PART_NUMBER_2: 1SS416L3MCT-ND; DIGI-KEY_PART_NUMBER_3: 1SS416L3MDKR-ND; DIGI-KEY_PART_NUMBER_4: 1SS416L3MTR-ND; MANUFACTURER_PART_NUMBER: 1SS416; MFR_NAME: Toshiba Electronic Devices & Storage Corp.
DELC1 SPI1 = con-lstb:MA04-2: PIN HEADER; OC_FARNELL: unknown; OC_NEWARK: unknown
GPIO SPI_CS+ UART = cederna:PINHD-1X2: PIN HEADER
INTAN JP4 MCU PWR = cederna:POWERJUMP: PIN HEADER
JTAG1 = Neilsen:JTAG: 10-pin JTAG connector for programming Atmel microcontrollers
K1 = Neilsen:ZXCT1010: Current sense monitor ZXCT1010 from Diodes Inc. (Digikey PN: ZXCT1010CT-ND). NOTE: When looking at the datasheet, Load = Vsense- and Vin = Vsense+
K2 K15 = LTC3388EDD-3_TRPBF:LTC3388EDD-3#TRPBF; DESCRIPTION: 20V High Efficiency Nanopower Step-Down Regulator; DIGI-KEY_PART_NUMBER: LTC3388EDD-3#TRPBFTR-ND; MF: Analog Devices; MP: LTC3388EDD-3#TRPBF; PACKAGE: DFN -10 Analog Devices; PURCHASE-URL: https://pricing.snapeda.com/search/part/LTC3388EDD-3#TRPBF/?ref=eda
K16 = Neilsen:MAX9142: Dual comparator - MAX9142 - Maxim
K17 = Neilsen:NC7SZ86: Two- Input Exclusive-OR Gate NC7SZ86
K18 = SN74LVC1G374DCKR:SN74LVC1G374DCKR; COPYRIGHT: Copyright (C) 2023 Ultra Librarian. All rights reserved.; MANUFACTURER_PART_NUMBER: SN74LVC1G374DCKR; MFR_NAME: Texas Instruments
K19 = Neilsen:IL712: 2 channel digital isolator - IL712 - NVE Corp.
K20 = DS1100LZ-500_:DS1100LZ-500+; DESCRIPTION: Delay Line IC Nonprogrammable 5 Tap 500ns 8-SOIC (0.154, 3.90mm Width); DIGI-KEY_PART_NUMBER: DS1100LZ-500+-ND; MF: Maxim Integrated; MP: DS1100LZ-500+; PACKAGE: SOIC-8 Maxim; PURCHASE-URL: https://pricing.snapeda.com/search/part/DS1100LZ-500+/?ref=eda
K23 = TPS3805H33MDCKREP:V62/04648-06XE; COPYRIGHT: Copyright (C) 2022 Ultra Librarian. All rights reserved.; DIGI-KEY_PART_NUMBER_1: 296-18152-2-ND; MANUFACTURER_PART_NUMBER: V62/04648-06XE; MFR_NAME: Texas Instruments
K27 = SN74LVC3G14DCUR:SN74LVC3G14DCUR; DESCRIPTION: 3-ch, 1.65-V to 5.5-V inverters with Schmitt-Trigger inputs; DIGI-KEY_PART_NUMBER: 296-13006-2-ND; MF: Texas Instruments; MP: SN74LVC3G14DCUR; PACKAGE: VSSOP-8 Texas Instruments; PURCHASE-URL: https://pricing.snapeda.com/search/part/SN74LVC3G14DCUR/?ref=eda
K28 = Neilsen:SN74AUP1G80: positive edge triggered D-flip flop
K29 = NC7SVL08FHX:NC7SVL08FHX; COPYRIGHT: Copyright (C) 2022 Ultra Librarian. All rights reserved.; DIGI-KEY_PART_NUMBER_1: NC7SVL08FHXTR-ND; DIGI-KEY_PART_NUMBER_2: NC7SVL08FHXCT-ND; DIGI-KEY_PART_NUMBER_3: NC7SVL08FHXDKR-ND; MANUFACTURER_PART_NUMBER: NC7SVL08FHX; MFR_NAME: onsemi
L1 L3 = Neilsen:INDUCTOR_: Generic inductor
Q2 = 2SARS523M2L:2SAR523MT2L; COPYRIGHT: Copyright (C) 2022 Ultra Librarian. All rights reserved.; DIGI-KEY_PART_NUMBER_1: 2SAR523MT2LCT-ND; DIGI-KEY_PART_NUMBER_2: 2SAR523MT2LDKR-ND; DIGI-KEY_PART_NUMBER_3: 2SAR523MT2LTR-ND; MANUFACTURER_PART_NUMBER: 2SAR523MT2L; MFR_NAME: ROHM Semiconductor
R1 = Neilsen:CG0603MLC: Chipguard MLC series varistor - 12VDC - Bourns
R2 R4-R11 R65-R67 R80-R85 = Neilsen:R_: Generic resistor
R3 R47 R52 R57 R58 R86 = WiSSCI_passives:R: Resistor; DIGIKEY_PN: P123047CT-ND; MFR: Panasonic Electronic Components; MFR_PN: ERJ-1GNF4992C
R48 R49 R53 R56 = WiSSCI_passives:R: Resistor; DIGIKEY_PN: P122413CT-ND; MFR: Panasonic Electronic Components; MFR_PN: ERJ-1GNF1001C
R50 R51 = WiSSCI_passives:R: Resistor; DIGIKEY_PN: P123340CT-ND; MFR: Panasonic Electronic Components; MFR_PN: ERJ-1GNJ512C
U1 = LTI1964IS5:LT1964IS5-SDTRMPBF; COPYRIGHT: Copyright (C) 2022 Ultra Librarian. All rights reserved.; MANUFACTURER_PART_NUMBER: LT1964IS5-SD#TRMPBF; MFR_NAME: Analog Devices Inc
U2 = STM32L433RC16:STM32L433RCI6
U$3 U$4 = cederna:40-PIN-SAMTEC
U$6 = WiNI:WINI_KINGBRIGHT_APHF1608LSEEQBDZGKC
U$10 = RHD2000:RHD2164_BGA: Intan Technologies RHD2164 chip, BGA package (9x7mm 104-pin)
X3 X4 = Neilsen:CRYSTAL_: Crystal oscillator

## Board
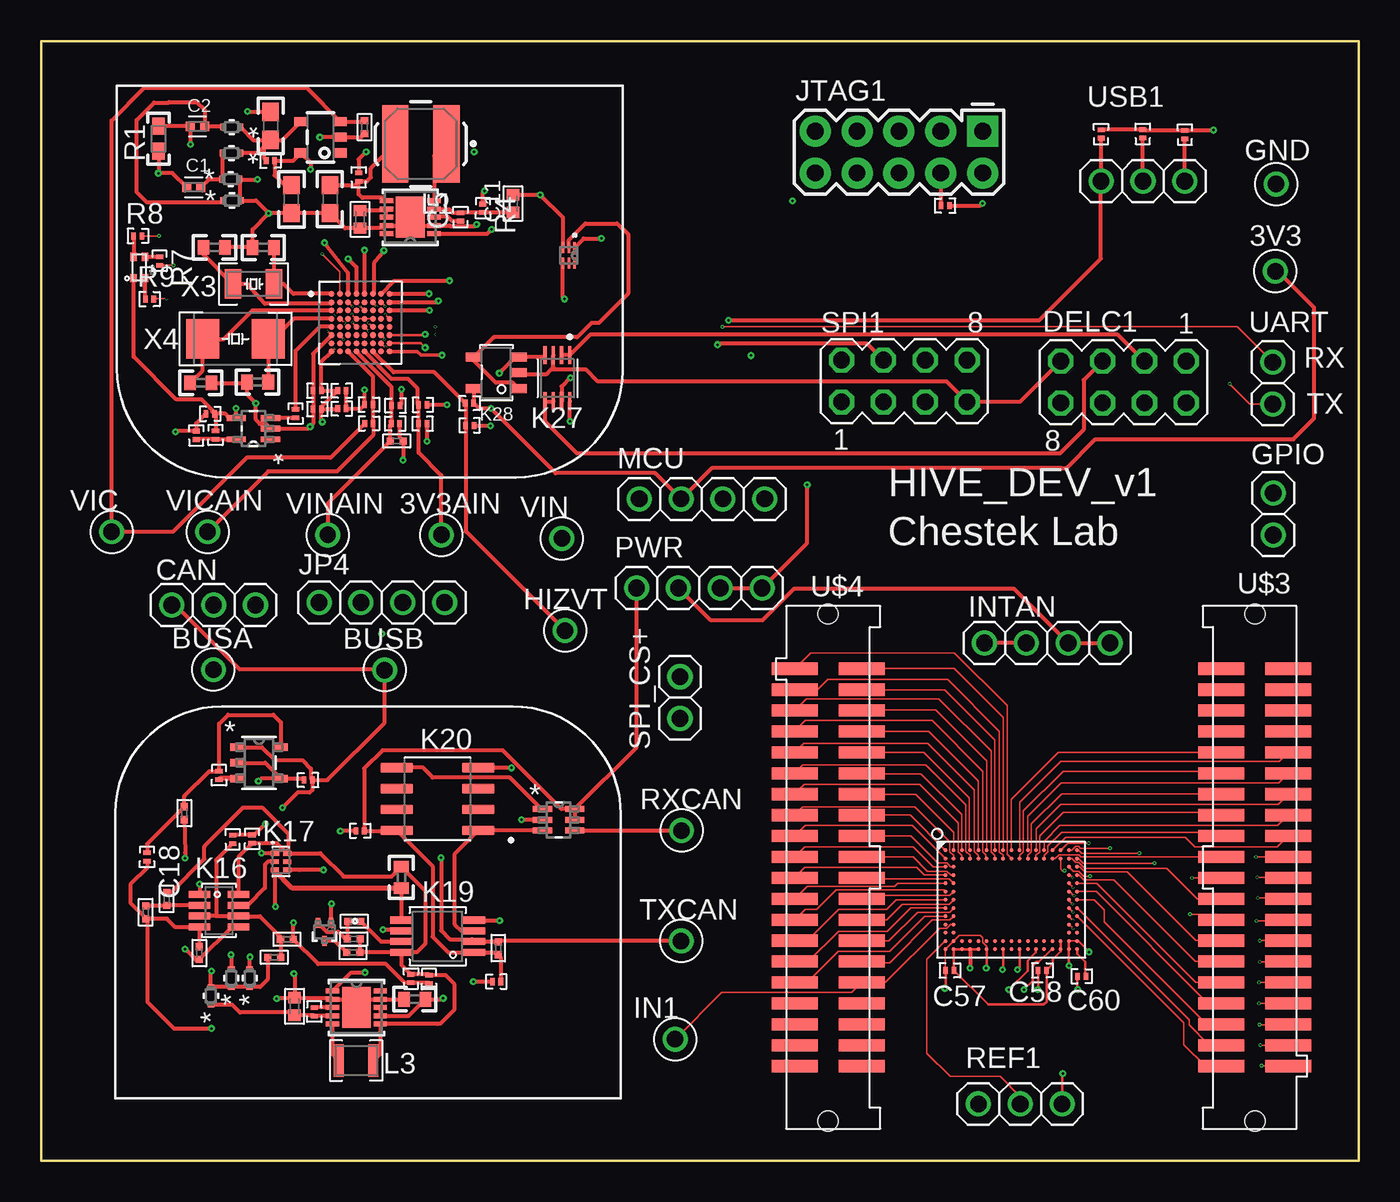
[diagram p8: board, top side]
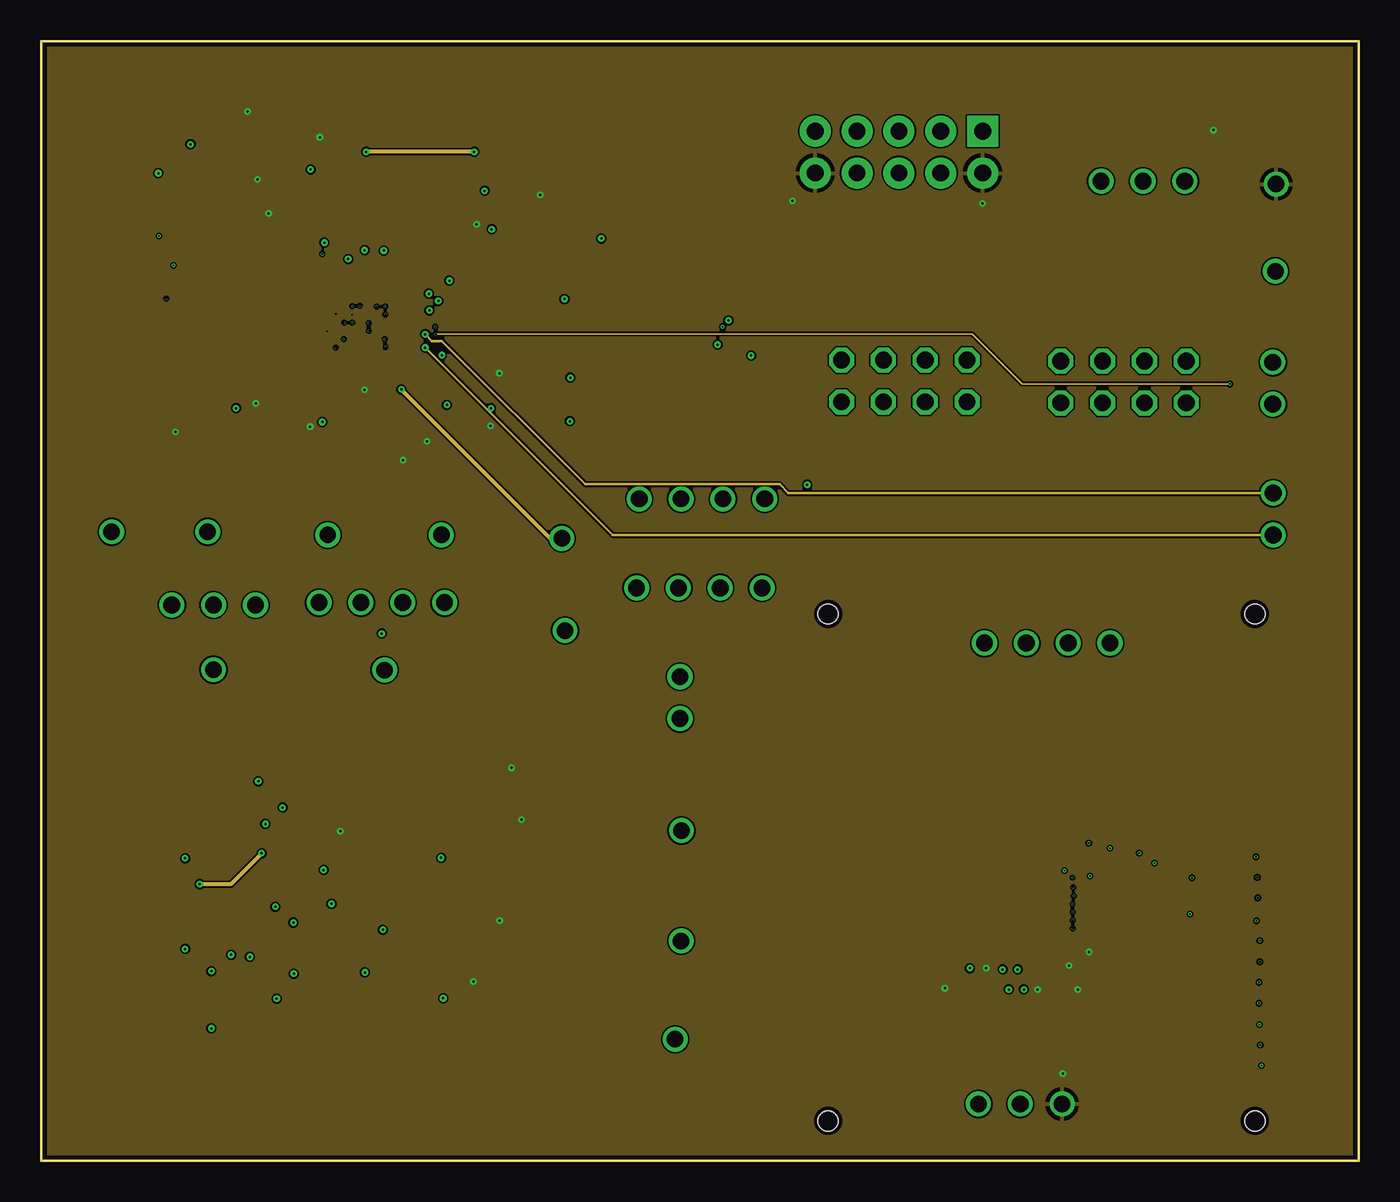
[diagram p9: board, inner layer Route2]
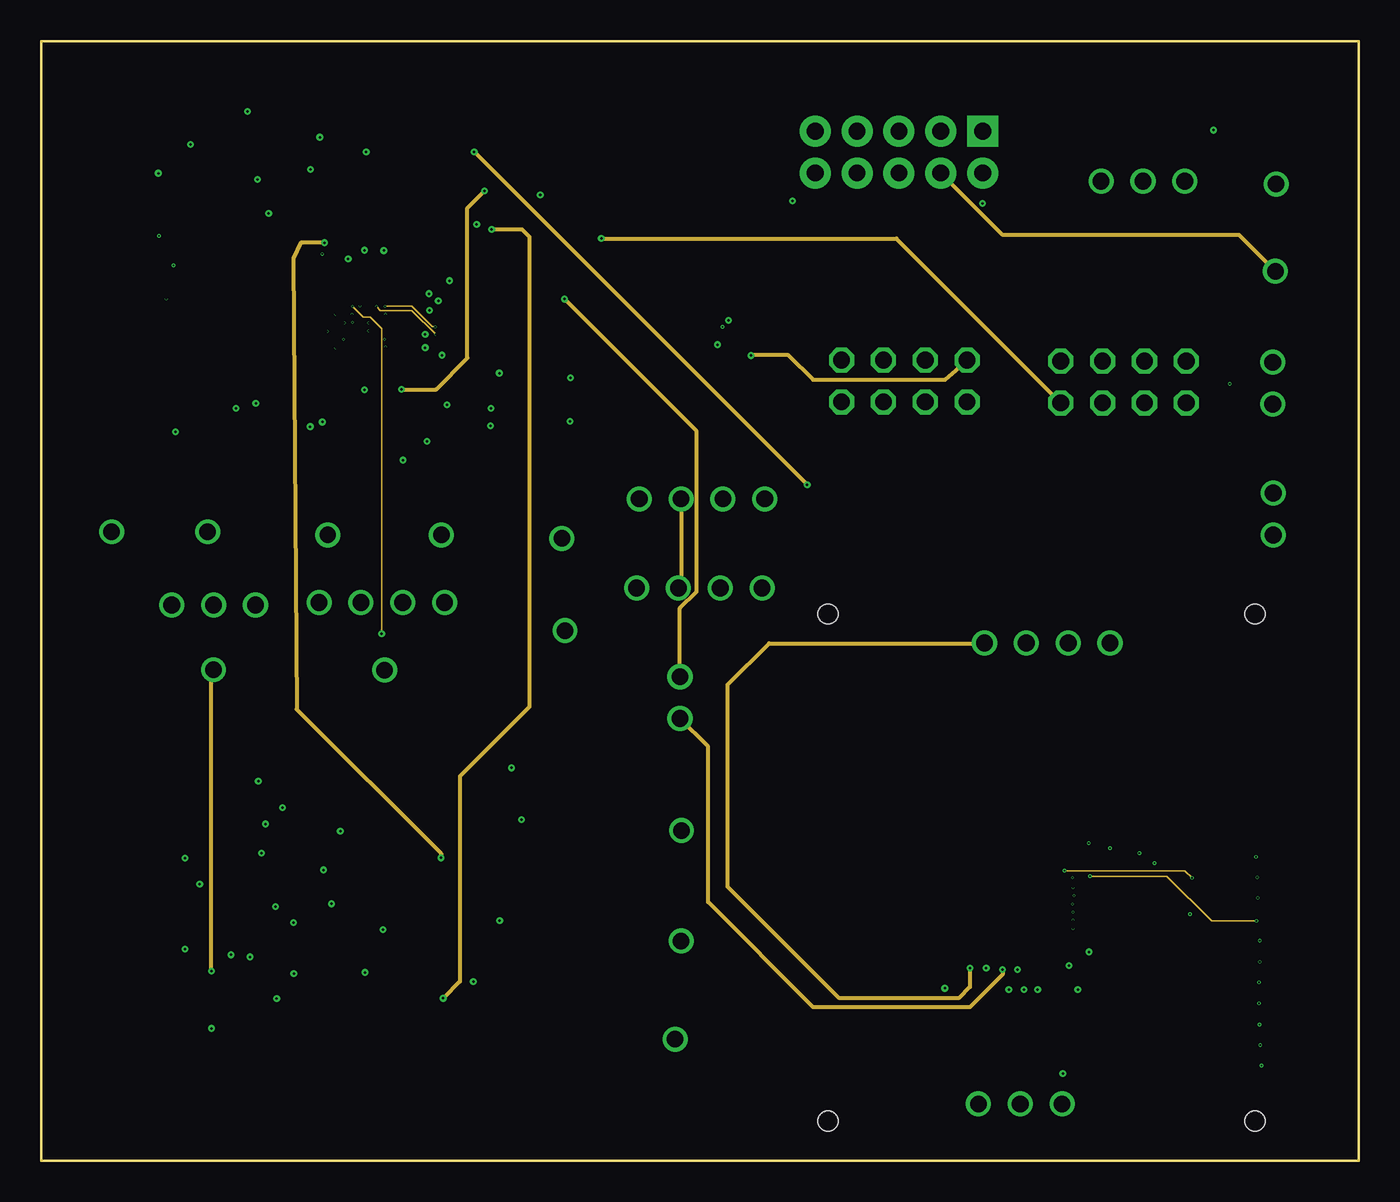
[diagram p10: board, inner layer Route15]
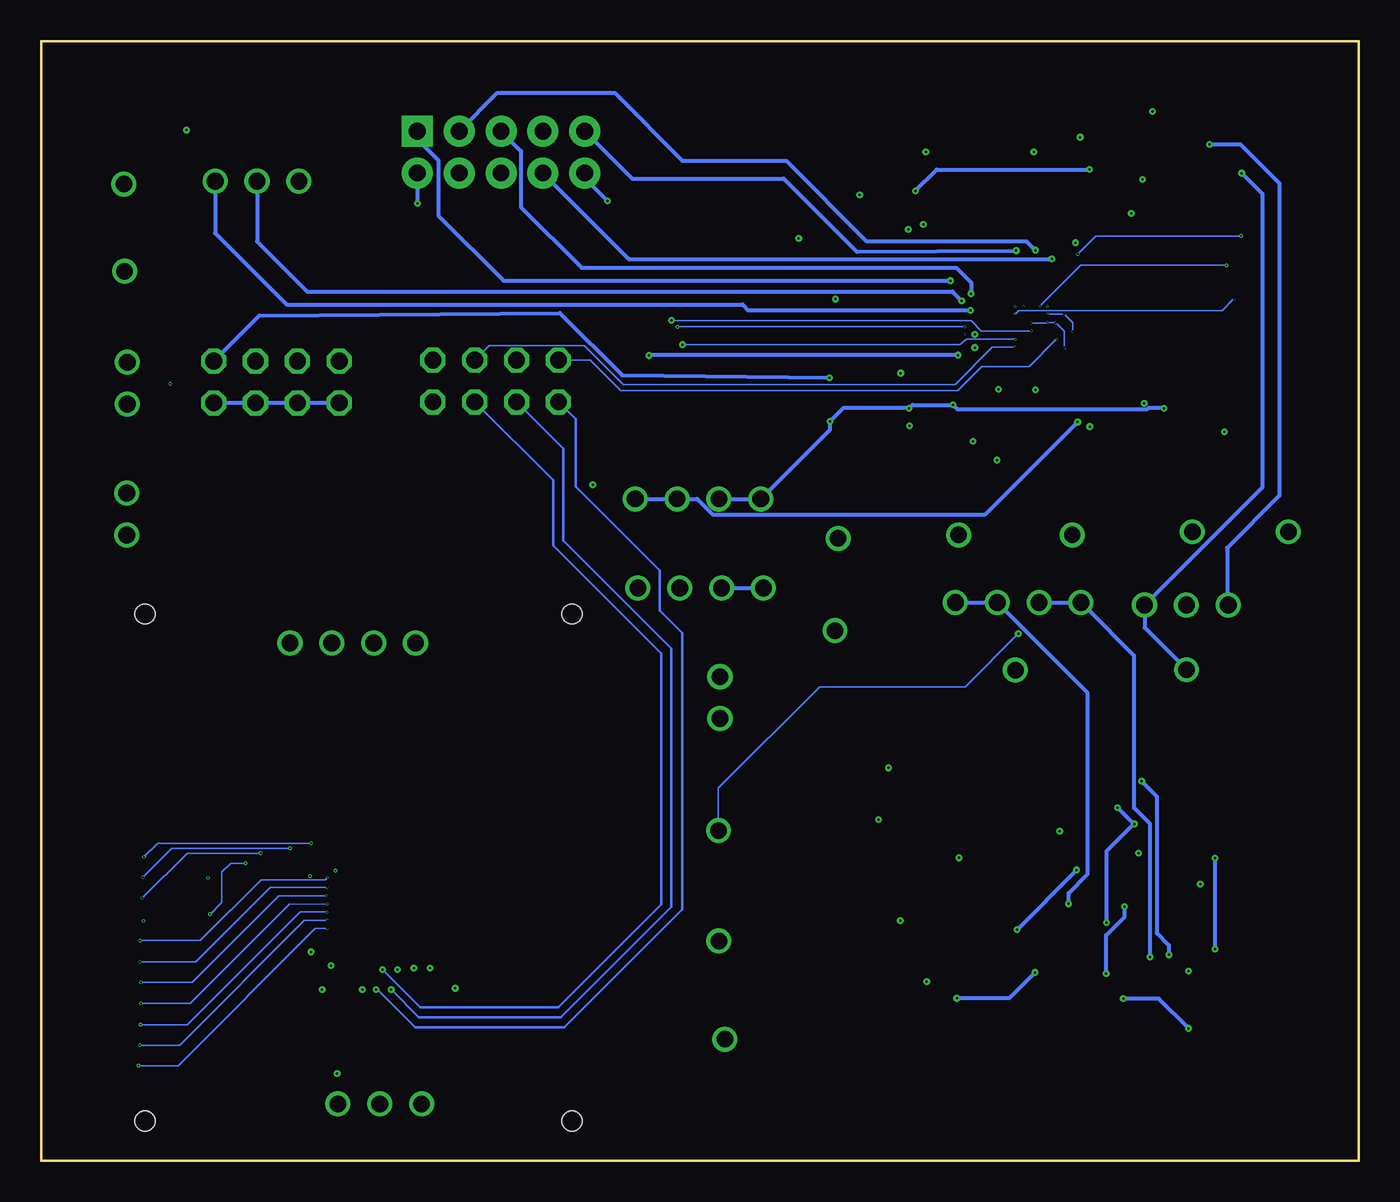
[diagram p11: board, bottom side, seen from below]

Size 80 x 68 mm. Coordinates in mm from the lower left corner, seen from the top.
Outline: 0,68 0,0 80,0 80,68 0,68
Copper layers (1*2+15*16): Top 0.035mm / dielectric 0.122mm / Route2 0.035mm / dielectric 1.15mm / Route15 0.035mm / dielectric 0.122mm / Bottom 0.035mm
Design rules "default *": minimum track width 4mil, minimum drill 8mil, track to track 4mil, track to pad 4mil, pad to pad 4mil, via to via 4mil, smd to smd 4mil, copper to edge 10mil, drill to drill 10mil, minimum pad ring 10mil, minimum via ring 0mil, stop-mask expansion 4mil, vias tented up to drill 0mil, thermal gap 10mil

### Footprints (pad centres in the part's own frame; a part is rotated, then mirrored left to right if it is on the bottom)
TP5000OR5001 = drill 1: P$1 0,0
CAPC1005X55N = smd 0.54 x 0.6: 1 -0.43,0; 2 0.43,0
C0603 = smd 1.1 x 1: 1 -0.85,0; 2 0.85,0
C0201 = smd 0.28 x 0.43: 1 -0.255,0; 2 0.255,0
C0402 = smd 0.7 x 0.9: 1 -0.65,0; 2 0.65,0
0402 = smd 0.686 x 0.762: 1 -0.533,0; 2 0.533,0
1X03 = drill 1.016: 1 -2.54,0; 2 0,0; 3 2.54,0
SOD-923_TOS = smd 0.33 x 0.406: 1 -0.539,0; 2 0.539,0
MA04-2 = drill 1.016 octagon: 1 -3.81,-1.27; 2 -3.81,1.27; 3 -1.27,-1.27; 4 -1.27,1.27; 5 1.27,-1.27; 6 1.27,1.27; 7 3.81,-1.27; 8 3.81,1.27
1X02 = drill 1.016: 1 -1.27,0; 2 1.27,0
1X04 = drill 1.016: 1 -3.81,0; 2 -1.27,0; 3 1.27,0; 4 3.81,0
JTAG-10 = drill 1.016 pad 1.88 square: 1 -5.08,-1.27 | drill 1.016 pad 1.88: 2 -5.08,1.27; 3 -2.54,-1.27; 4 -2.54,1.27; 5 0,-1.27; 6 0,1.27; 7 2.54,-1.27; 8 2.54,1.27; 9 5.08,-1.27; 10 5.08,1.27
SOT25 = smd 0.55 x 0.8: 1 -0.95,-1.2; 2 0,-1.2; 3 0.95,-1.2; 4 0.95,1.2; 5 -0.95,1.2
DFN-10_DD = smd 0.813 x 0.305: 1 -1.448,1; 2 -1.448,0.5; 3 -1.448,0; 4 -1.448,-0.5; 5 -1.448,-1; 6 1.448,-1; 7 1.448,-0.5; 8 1.448,0; 9 1.448,0.5; 10 1.448,1 | smd 1.753 x 2.489: 11 0,0
SOT23-8 = smd 0.42 x 1.3: 1 -0.975,-1.175; 2 -0.325,-1.175; 3 0.325,-1.175; 4 0.975,-1.175; 5 0.975,1.175; 6 0.325,1.175; 7 -0.325,1.175; 8 -0.975,1.175
MAC06A = smd 0.3 x 0.52: 1 -0.5,-0.36 | smd 0.3 x 0.49: 2 0,-0.375; 3 0.5,-0.375; 4 0.5,0.375; 5 0,0.375; 6 -0.5,0.375
DCK6 = smd 1.168 x 0.356: 1 -0.978,0.65; 2 -0.978,0; 3 -0.978,-0.65; 4 0.978,-0.65; 5 0.978,0; 6 0.978,0.65
MSOP-8 = smd 0.43 x 1.36: 1 -0.975,-2.205; 2 -0.325,-2.205; 3 0.325,-2.205; 4 0.975,-2.205; 5 0.975,2.205; 6 0.325,2.205; 7 -0.325,2.205; 8 -0.975,2.205
SOIC127P600X175-8N = smd 1.97 x 0.59: 1 -2.475,1.905; 2 -2.475,0.635; 3 -2.475,-0.635; 4 -2.475,-1.905; 5 2.475,-1.905; 6 2.475,-0.635; 7 2.475,0.635; 8 2.475,1.905
DCK5 = smd 1.168 x 0.356: 1 -1.041,0.65; 2 -1.041,0; 3 -1.041,-0.65; 4 1.041,-0.65; 5 1.041,0.65
SOP50P310X90-8N = smd 1.12 x 0.27: 1 -1.405,0.75; 2 -1.405,0.25; 3 -1.405,-0.25; 4 -1.405,-0.75; 5 1.405,-0.75; 6 1.405,-0.25; 7 1.405,0.25; 8 1.405,0.75
SOT23-5 = smd 0.55 x 1: 1 -0.95,-1.35; 2 0,-1.35; 3 0.95,-1.35; 4 0.95,1.35; 5 -0.95,1.35
MICROPAK2-6_1X1_ONS = smd 0.66 x 0.152: 1 -0.47,0.35; 2 -0.47,0; 3 -0.47,-0.35; 4 0.47,-0.35; 5 0.47,0; 6 0.47,0.35
LPS4414 = smd 1.6 x 4.7: P$1 -1.55,0; P$2 1.55,0
CB2518 = smd 0.6 x 2: 1 -1.05,0; 2 1.05,0
TRANS_2SAR522M_ROM = smd 0.279 x 0.61: 1 -0.4,-0.546; 2 0.4,-0.546; 3 0,0.546
CG0603MLC = smd 1.02 x 0.76: 1 -0.76,0; 2 0.76,0
R0201 = smd 0.28 x 0.43: 1 -0.255,0; 2 0.255,0
0201 = smd 0.432 x 0.432: 1 -0.394,0; 2 0.394,0
TSOT23-5_S5_ADI = smd 0.876 x 0.457: 1 -1.314,0.95; 2 -1.314,0; 3 -1.314,-0.95; 4 1.314,-0.95; 5 1.314,0.95
BGA64N50P8X8_500X500X60N = smd 0.35 x 0.35: A1 -1.75,1.75; A2 -1.25,1.75; A3 -0.75,1.75; A4 -0.25,1.75; A5 0.25,1.75; A6 0.75,1.75; A7 1.25,1.75; A8 1.75,1.75; B1 -1.75,1.25; B2 -1.25,1.25; B3 -0.75,1.25; B4 -0.25,1.25; B5 0.25,1.25; B6 0.75,1.25; B7 1.25,1.25; B8 1.75,1.25; C1 -1.75,0.75; C2 -1.25,0.75; C3 -0.75,0.75; C4 -0.25,0.75; C5 0.25,0.75; C6 0.75,0.75; C7 1.25,0.75; C8 1.75,0.75; D1 -1.75,0.25; D2 -1.25,0.25; D3 -0.75,0.25; D4 -0.25,0.25; D5 0.25,0.25; D6 0.75,0.25; D7 1.25,0.25; D8 1.75,0.25; E1 -1.75,-0.25; E2 -1.25,-0.25; E3 -0.75,-0.25; E4 -0.25,-0.25; E5 0.25,-0.25; E6 0.75,-0.25; E7 1.25,-0.25; E8 1.75,-0.25; F1 -1.75,-0.75; F2 -1.25,-0.75; F3 -0.75,-0.75; F4 -0.25,-0.75; F5 0.25,-0.75; F6 0.75,-0.75; F7 1.25,-0.75; F8 1.75,-0.75; G1 -1.75,-1.25; G2 -1.25,-1.25; G3 -0.75,-1.25; G4 -0.25,-1.25; G5 0.25,-1.25; G6 0.75,-1.25; G7 1.25,-1.25; G8 1.75,-1.25; H1 -1.75,-1.75; H2 -1.25,-1.75; H3 -0.75,-1.75; H4 -0.25,-1.75; H5 0.25,-1.75; H6 0.75,-1.75; H7 1.25,-1.75; H8 1.75,-1.75
SAMTECSFH120-01-X-D-SM-LC = smd 0.737 x 2.794: P$1 -12.065,-2.032; P$2 -12.065,2.032; P$3 -10.795,-2.032; P$4 -10.795,2.032; P$5 -9.525,-2.032; P$6 -9.525,2.032; P$7 -8.255,-2.032; P$8 -8.255,2.032; P$9 -6.985,-2.032; P$10 -6.985,2.032; P$11 -5.715,-2.032; P$12 -5.715,2.032; P$13 -4.445,-2.032; P$14 -4.445,2.032; P$15 -3.175,-2.032; P$16 -3.175,2.032; P$17 -1.905,-2.032; P$18 -1.905,2.032; P$19 -0.635,-2.032; P$20 -0.635,2.032; P$21 0.635,-2.032; P$22 0.635,2.032; P$23 1.905,-2.032; P$24 1.905,2.032; P$25 3.175,-2.032; P$26 3.175,2.032; P$27 4.445,-2.032; P$28 4.445,2.032; P$29 5.715,-2.032; P$30 5.715,2.032; P$31 6.985,-2.032; P$32 6.985,2.032; P$33 8.255,-2.032; P$34 8.255,2.032; P$35 9.525,-2.032; P$36 9.525,2.032; P$37 10.795,-2.032; P$38 10.795,2.032; P$39 12.065,-2.032; P$40 12.065,2.032 | hole 1.2: 15.392,0; -15.392,0
WINI_4-SMD = smd 0.5 x 0.4: B 1.3,-0.7; G 1.3,0; R 0,-0.7; V+ 0,0
BGA104_9X7 = smd 0.25 x 0.25: A1 -4,3; A2 -3.5,3; A3 -3,3; A4 -2.5,3; A5 -2,3; A6 -1.5,3; A7 -1,3; A8 -0.5,3; A9 0,3; A10 0.5,3; A11 1,3; A12 1.5,3; A13 2,3; A14 2.5,3; A15 3,3; A16 3.5,3; A17 4,3; B1 -4,2.5; B2 -3.5,2.5; B3 -3,2.5; B4 -2.5,2.5; B5 -2,2.5; B6 -1.5,2.5; B7 -1,2.5; B8 -0.5,2.5; B9 0,2.5; B10 0.5,2.5; B11 1,2.5; B12 1.5,2.5; B13 2,2.5; B14 2.5,2.5; B15 3,2.5; B16 3.5,2.5; B17 4,2.5; C1 -4,2; C2 -3.5,2; C16 3.5,2; C17 4,2; D1 -4,1.5; D2 -3.5,1.5; D16 3.5,1.5; D17 4,1.5; E1 -4,1; E2 -3.5,1; E16 3.5,1; E17 4,1; F1 -4,0.5; F2 -3.5,0.5; F16 3.5,0.5; F17 4,0.5; G1 -4,0; G2 -3.5,0; G16 3.5,0; G17 4,0; H1 -4,-0.5; H2 -3.5,-0.5; H16 3.5,-0.5; H17 4,-0.5; J1 -4,-1; J2 -3.5,-1; J16 3.5,-1; J17 4,-1; K1 -4,-1.5; K2 -3.5,-1.5; K16 3.5,-1.5; K17 4,-1.5; L1 -4,-2; L2 -3.5,-2; L16 3.5,-2; L17 4,-2; M1 -4,-2.5; M2 -3.5,-2.5; M3 -3,-2.5; M4 -2.5,-2.5; M5 -2,-2.5; M6 -1.5,-2.5; M7 -1,-2.5; M8 -0.5,-2.5; M9 0,-2.5; M10 0.5,-2.5; M11 1,-2.5; M12 1.5,-2.5; M13 2,-2.5; M14 2.5,-2.5; M15 3,-2.5; M16 3.5,-2.5; M17 4,-2.5; N1 -4,-3; N2 -3.5,-3; N3 -3,-3; N4 -2.5,-3; N5 -2,-3; N6 -1.5,-3; N7 -1,-3; N8 -0.5,-3; N9 0,-3; N10 0.5,-3; N11 1,-3; N12 1.5,-3; N13 2,-3; N14 2.5,-3; N15 3,-3; N16 3.5,-3; N17 4,-3
ABS07 = smd 1 x 1.8: 1 -1.25,0; 2 1.25,0
NX5032GA = smd 2 x 2.4: 1 -2,0; 2 2,0

### Placement (x,y rotation side)
3V3  74.93,54.02 0 top
3V3AIN  24.29,38.01 0 top
BUSA  10.46,29.83 0 top
BUSB  20.85,29.8 0 top
C1  9.27,59.12 0 top
C2  9.49,62.82 0 top
C3  13.93,62.85 270 top
C4  15.2,58.39 90 top
C5  25.46,57.32 90 top
C6  17.53,58.41 270 top
C7  16.76,46.77 0 top
C8  16.76,45.65 0 top
C9  18.26,46.77 180 top
C10  22.67,9.81 180 top
C11  28.65,58.14 90 top
C12  19.35,57.17 90 top
C13  18.26,45.68 180 top
C14  15.39,9.37 90 top
C15  54.89,58.01 180 top
C18  6.43,18.45 270 top
C46  11.62,19.52 90 top
C47  10.8,23.41 270 top
C48  21.87,17.2 90 top
C49  12.8,19.53 270 top
C50  23.55,11.02 270 top
C51  16.21,23.12 180 top
C52  16.58,9.05 270 top
C54  22.45,11.06 90 top
C55  27.65,10.88 180 top
C56  19.36,20.04 0 top
C57  55.17,11.56 0 top
C58  60.78,11.56 0 top
C60  63.17,11.21 0 top
C61  10.26,45.37 0 top
C62  13.14,47.29 180 top
C63  9.69,47.24 0 top
C64  10.52,55.47 0 top
C65  13.49,55.46 180 top
C82  19.89,45.93 0 top
C83  21.51,44.77 180 top
CAN  10.47,33.75 180 top
D1  11.55,61.2 180 top
D2  11.57,62.78 180 top
D3  11.51,59.62 0 top
D4  11.59,58.32 0 top
D8  12.66,11.09 90 top
D9  10.3,10.02 90 top
D10  11.54,11.1 90 top
DELC1  65.71,47.3 180 top
GND  74.99,59.32 0 top
GPIO  74.8,39.28 270 top
HIZVT  31.81,32.2 0 top
IN1  38.5,7.38 0 top
INTAN  61.08,31.44 180 top
JP4  20.68,33.9 180 top
JTAG1  52.08,61.26 180 top
K1  16.96,62.16 90 top
K2  22.41,57.3 180 top
K15  19.14,9.3 0 top
K16  10.8,15.19 270 top
K17  14.55,18.17 270 top
K18  31.42,20.71 0 top
K19  24.07,13.64 90 top
K20  24.07,21.97 180 top
K23  12.89,44.47 180 top
K27  31.34,47.52 270 top
K28  27.63,47.86 90 top
K29  32.04,54.99 270 top
L1  23.05,61.76 180 top
L3  19.12,6.08 0 top
MCU  40.12,40.2 0 top
PWR  39.96,34.79 0 top
Q2  17.2,13.9 180 top
R1  7.12,62.07 90 top
R2  13.92,60.74 0 top
R3  19.63,62.78 90 top
R4  26.82,57.85 270 top
R5  19.28,59.74 90 top
R6  64.35,62.36 90 top
R7  7.19,54.64 270 top
R8  5.87,56.17 0 top
R9  6.58,52.33 0 top
R10  66.88,62.37 90 top
R11  69.44,62.33 90 top
R47  14.15,12.36 180 top
R48  14.92,13.45 180 top
R49  18.94,12.65 0 top
R50  18.98,13.47 0 top
R51  19,14.54 180 top
R52  7.62,15.91 90 top
R53  6.34,15.09 270 top
R56  9.61,12.61 270 top
R57  8.7,21.11 270 top
R58  27.75,12.91 270 top
R65  10.59,44.08 270 top
R66  9.41,44.06 90 top
R67  15.44,45.37 270 top
R80  26,46.01 0 top
R81  26.02,44.66 180 top
R82  23.17,45.91 0 top
R83  23.17,44.77 180 top
R84  21.52,45.87 180 top
R85  19.9,44.78 0 top
R86  21.59,43.72 180 top
REF1  59.44,3.45 0 top
RXCAN  38.88,20.05 0 top
SPI1  52.4,47.36 0 top
SPI_CS+  38.78,28.13 90 top
TXCAN  38.86,13.35 0 top
U1  13.23,24.16 0 top
U2  19.38,50.9 0 top
U$3  73.68,17.81 90 top
U$4  47.78,17.81 270 top
U$6  5.61,53.6 90 top
U$10  58.9,15.85 0 top
UART  74.78,47.23 270 top
USB1  66.89,59.5 180 top
VIC  4.28,38.2 0 top
VICAIN  10.11,38.2 0 top
VIN  31.61,37.8 0 top
VINAIN  17.4,38.01 0 top
X3  12.89,53.25 180 top
X4  11.8,49.92 0 top

### Tracks (layer width: path | path; a pad name or v marks a point on that pad's centre or on a via)
3V3  (via drill 0.15 pad 0.41)
  Top 0.254: C61.2 11.16,45.37 11.41,45.12 K23.4 v11.85,45.69 v11.84,45.7 | C61.2 10.59,45.3 R65.1 | C61.2 10.37,45.51 10.37,45.6 9.74,46.23 8.21,46.23 5.61,48.83 U$6.V+ | v24.64,45.91 R82.2 | K28.5 26.28,46.03 R80.2 26.56,45.7 v27.3,45.7 31.24,41.77 37.28,41.77 MCU.2 40.75,42.1 61.9,42.1 61.92,42.07 62.25,42.07 64.01,43.82 76.02,43.82 77.29,45.09 77.29,51.82 75.09,54.02 3V3.P$1 | v32.11,44.91 v32.09,44.93 K27.8 | C55.1 27.9,12.36 R58.2 27.61,12.66 K19.1 24.71,12.66 23.77,13.6 23.77,17.89 K20.8 21.57,20.04 C56.2 19.62,23.81 20.73,24.93 28.02,24.93 31.59,21.36 K18.6 | INTAN.1 INTAN.2 59.06,34.73 45.69,34.73 43.79,32.83 40.65,32.83 PWR.2 | JTAG1.4 54.62,58.03 C15.2 | K18.6 K18.5 | K18.6 36.15,25.11 PWR.1
  Route15 0.254: MCU.2 38.85,34.95 PWR.2 | 3V3.P$1 72.73,56.22 58.39,56.22 JTAG1.4
  Bottom 0.254: MCU.2 MCU.1 32.11,44.4 v32.11,44.91 31.32,45.7 v27.3,45.7 27.1,45.91 v24.64,45.91 24.36,45.63 12.87,45.63 12.79,45.7 v11.84,45.7 | PWR.2 PWR.1
3V3AIN
  Top 0.254: U2.H5 19.63,49.13 21.28,47.48 22.27,47.48 22.86,46.9 22.86,45.96 R82.1 R83.2 22.91,43.01 24.29,41.63 3V3AIN.P$1
3V3BUS
  Top 0.254: K16.8 11.97,18.45 C49.2 14.32,19.28 K17.6 | L3.2 20.59,6.5 K15.6 24.07,8.3 24.08,8.31 24.23,8.31 25.07,9.15 25.07,10.75 24.54,11.29 C50.1 23.51,11.32 C54.2 21.87,11.9 K19.8 | K19.8 21.86,12.65 R49.2 19.37,12.69 R50.2 | K19.8 22.81,12.66 23.32,13.16 23.32,16.4 C48.2 21.27,17.25 18.36,17.25 16.95,18.67 K17.6 | R52.2 7.89,16.3 9.9,18.32 9.9,19.08 12.27,21.45 13.41,21.45 15.01,19.85 15.01,18.75 K17.6
3V3BUS2  (via drill 0.15 pad 0.41)
  Top 0.254: Q2.1 17.6,15.58 v17.63,15.6
  Bottom 0.254: v17.63,15.6 17.63,16.24 16.46,17.41 16.46,28.41 JP4.2 JP4.1
BA_ISO
  Top 0.254: D1.2 11.01,59.66 D3.1 10.2,59.62 C1.2
BB_ISO
  Top 0.254: D2.2 10.99,62.82 C2.2 9.92,63.82 9.45,64.3 7.77,64.3 7.75,64.27 6.86,64.27 5.79,63.2 5.79,58.84 6.42,58.2 10.93,58.2 D4.1
BUSA  (via drill 0.15 pad 0.41)
  Top 0.254: R47.2 13.75,11 13.3,10.55 D8.1 11.55,10.55 D10.1 D9.2 10.3,11.48 v10.34,11.51 | R1.1 7.12,59.99 | 7.12,59.99 v7.11,59.98 | C1.1 7.97,59.99 7.12,59.99
  Route15 0.254: v10.34,11.51 10.34,29.7 BUSA.P$1
  Bottom 0.254: BUSA.P$1 13.01,32.38 CAN.1 5.84,40.92 5.84,58.71 v7.11,59.98
BUSB_GND  (via drill 0.15 pad 0.41)
  Top 0.254: C50.2 23.51,10.81 C54.1 22.07,10.81 20.93,11.95 16.82,11.95 R48.1 v15.32,14.46 | C46.2 12.79,19.78 C49.1 12.95,19.79 v13.61,20.45 | R1.2 9.05,62.83 C2.1 v9.06,61.74 v9.07,61.73 | v15.32,14.46 | U1.1 13.4,25.11 14.17,24.34 15.85,24.34 16.38,23.81 16.38,23.2 C51.1 | C51.1 17.37,23.12 20.85,26.6 BUSB.P$1 20.85,29.85 12.03,29.85 8.13,33.75 CAN.3 | C51.1 16.46,22.52 16.31,22.36 15.57,22.36 v14.66,21.45
  Bottom 0.254: v14.66,21.45 13.66,20.45 | 13.66,20.45 v13.61,20.45 | v15.32,14.46 15.32,18.8 13.66,20.45 | v9.07,61.73 7.19,61.73 4.83,59.37 4.83,40.39 8,37.22 8,33.82 CAN.3
CMPX
  Top 0.254: K19.3 25.49,13.96 25.12,14.33 25.12,18.64 K20.1 26.55,20.06 K18.3
CMPXBUS  (via drill 0.15 pad 0.41)
  Top 0.254: K19.6 21.8,14.03 v20.75,14.03 | v17.14,17.66 15.67,17.66 15.67,17.67 K17.4
  Bottom 0.254: v20.75,14.03 17.14,17.64 v17.14,17.66
GND  (via drill 0.1 pad 0.15, 0.15 pad 0.41)
  Top 0.102: U2.D6 U2.D5 U2.D4 19.12,51.14 v18.87,51.39 | U2.C2 18.11,51.64 v17.88,51.42 | U2.F1 17.41,50.37 v17.38,50.37 v17.37,50.38 | C57.1 54.9,11.57 U$10.N1 U$10.M2 55.75,13.7 57.02,13.7 57.17,13.55 57.17,13.25 57.4,13.03 U$10.N6 | U$10.M16 U$10.M17
  Top 0.152: U$10.M17 62.96,13.35 v63.63,12.68 | C60.1 62.91,10.57 v62.94,10.4 | U$10.M16 U$10.N16 62.4,11.85 v62.41,11.84 | C57.1 54.91,10.52 v54.86,10.47 | C58.1 60.53,10.42 v60.5,10.4 | U$10.N6 57.4,11.71 v57.38,11.69 | REF1.3 61.98,5.25 v62.03,5.29
  Top 0.254: C63.2 12.44,47.24 C62.2 12.49,46.55 v13.03,46.01 13.03,45 13.27,44.76 13.63,44.76 K23.2 16.21,44.47 v16.33,44.59 16.51,44.76 C8.1 C7.1 16.51,49.02 U2.F1 | C64.2 12.83,55.47 C65.2 12.84,56.56 v13.82,57.54 | C61.1 9.41,44.78 R66.2 8.19,44.31 v8.15,44.28 | K27.4 30.47,48.81 K28.3 28.79,48.81 v27.81,47.84 | K20.4 28.53,23.88 v28.55,23.86 | C56.1 18.18,20.04 v18.16,20.02 | K19.4 27.81,14.61 v27.84,14.59 | C83.1 21.76,43.94 R86.1 21.99,42.57 v21.97,42.55 | R83.1 v23.42,43.7 | R81.1 26.3,44.64 v27.28,44.64 | R6.2 66.87,62.61 R10.2 66.93,62.58 R11.2 v71.17,62.58 v71.17,62.59 | C55.2 v26.24,10.88 | v13.82,57.54 C4.1 15.21,57.56 C6.2 18.45,56.64 C12.1 20.8,56.64 K2.9 21.91,56.8 K2.11 22.91,56.8 K2.2 24.79,56.8 24.84,56.75 26.31,56.75 v26.44,56.88 | v13.13,59.6 12.07,59.6 D3.2 12.05,58.4 D4.2 13.04,58.32 v13.82,57.54 | C3.1 12.56,63.7 v12.52,63.74 | R3.1 19.4,62.16 K1.2 v16.92,62.16 v16.91,62.16 | C15.1 57.01,58.01 v57.15,58.15 | C11.2 v30.29,58.67 v30.3,58.66 31.69,57.27 K29.3 | v19.63,46.82 v19.64,46.82 C82.1 19.37,45.66 18.53,45.66 C13.1 C9.1 | K18.2 v29.16,20.71
  Bottom 0.102: v18.87,51.39 18.85,51.42 v17.88,51.42 17.37,50.91 v17.37,50.38
  Bottom 0.254: JTAG1.10 47,59.68 v45.62,58.3 | JTAG1.2 v57.16,58.16 v57.15,58.15
  pour Route2 (isolate 0.016): 0,68 80,68 80,60.5 80,0 0,0
HIZVT
  Top 0.254: HIZVT.P$1 25.76,38.24 R81.2 25.76,45.99 R80.1 23.87,47.89 21.39,47.89 U2.H6
INTAN_CS  (via drill 0.15 pad 0.41)
  Top 0.203: U2.H8 22.84,49.14 23.06,48.93 v24.33,48.93
  Route15 0.254: SPI1.8 56.21,48.6 54.89,47.43 46.86,47.43 45.36,48.93 43.13,48.93 v43.1,48.9
  Bottom 0.254: v24.33,48.93 43.08,48.93 v43.1,48.9
INTAN_MISO  (via drill 0.1 pad 0.15)
  Top 0.102: U2.F2 18.13,50.12 v18.36,49.89
  Bottom 0.102: SPI1.2 46.66,48.63 44.8,46.77 24.36,46.77 22.88,48.24 20.01,48.24 v18.36,49.89
INTAN_MOSI  (via drill 0.1 pad 0.15, 0.15 pad 0.41)
  Top 0.102: v20.85,49.89 20.76,50.02 U2.F7
  Top 0.254: v41.07,49.56 41.17,49.56 41.22,49.61 50.15,49.61 SPI1.4
  Bottom 0.102: v41.07,49.56 24.23,49.56 23.8,49.89 v20.85,49.89
INTAN_SCK  (via drill 0.1 pad 0.15)
  Top 0.102: v20.91,49.42 20.86,49.42 U2.G7
  Bottom 0.102: SPI1.6 52.79,49.51 47.01,49.51 44.65,47.15 24.51,47.15 22.27,49.39 22.29,49.39 22.26,49.42 v20.91,49.42
LED_B  (via drill 0.1 pad 0.18, 0.1 pad 0.2)
  Top 0.102: U2.A2 18.13,54.01 v17.07,55.08 | v7.16,56.17 R8.2
  Bottom 0.102: v17.07,55.08 15.98,56.17 v7.16,56.17
LED_G  (via drill 0.1 pad 0.15, 0.1 pad 0.2)
  Top 0.102: R7.2 v8.02,54.39 v8.03,54.39 | v19.35,51.93 U2.C5
  Bottom 0.102: v8.03,54.39 16.89,54.39 v19.35,51.93
LED_R  (via drill 0.1 pad 0.15)
  Top 0.102: v7.59,52.36 6.86,52.36 R9.2 | v20.9,51.39 U2.D8
  Bottom 0.102: v7.59,52.36 8.3,51.65 20.63,51.65 20.88,51.39 v20.9,51.39
N$1
  Top 0.254: K2.4 24.76,57.79 24.98,57.58 C5.2 26.81,57.58 R4.2 28.64,57.59 C11.1
N$2
  Top 0.254: U2.E1 16.91,50.66 15.44,49.18 R67.1
N$3
  Top 0.102: U$10.K2 55.22,14.35 54.99,14.12 54.55,14.12 51.26,10.83 U$4.P$32 49.2,10.22 41.33,10.22 IN1.P$1
N$4
  Top 0.254: C12.2 20.87,57.71 K2.7 K2.8
N$5
  Top 0.254: L1.P$2 20.01,60.27 20.01,59.72 19.78,59.48 R5.1 | R5.1 19.05,59.26 C6.1 | K2.6 20.78,58.48 19.51,58.48 19.28,58.7 R5.1
N$6
  Top 0.254: C5.1 24.95,57.07 24.69,57.34 23.89,57.34 K2.3
N$7
  Top 0.254: K1.4 14.65,62 C3.2 | D2.1 12.89,62 C3.2 | 13.55,61.62 C3.2 | 13.55,61.62 13.13,61.2 D1.1 | R2.1 13.55,60.86 13.55,61.62
N$8
  Top 0.254: L1.P$1 23.86,61.02 K2.5
N$9
  Top 0.254: L3.1 17.69,6.46 K15.5
N$10  (via drill 0.15 pad 0.41)
  Top 0.254: K17.3 14.18,17.63 14.18,15.47 v14.22,15.43 | R56.1 9.62,13.02 K16.4 9.59,14.18 8.15,14.18 7.64,14.7 R53.2 | C14.2 17.59,9.91 K15.2 18.64,9.8 K15.11 19.64,9.8 K15.9 C10.2 | R53.2 6.34,14.74 5.41,15.67 5.41,16.77 6.42,17.79 C18.2 | R53.2 6.45,14.59 6.45,9.64 8.05,8.04 v10.34,8.04 | v14.3,9.84 14.37,9.91 C14.2 | C48.1 K19.5 | C14.2 15.39,11.32 v15.34,11.36
  Top 0.305: C48.1 15.26,16.55 14.18,17.63
  Bottom 0.254: v10.34,8.04 12.14,9.84 v14.3,9.84 | v15.34,11.36 15.34,13.7 14.22,14.82 v14.22,15.43
N$11
  Top 0.254: K15.3 C52.1
N$12
  Top 0.254: K20.5 23.17,23.88 23.77,23.27 28.45,23.27 30.36,21.36 K18.1
N$13
  Top 0.254: R49.1 17.84,13.35 Q2.3
N$14
  Top 0.152: U$10.N17 62.9,12.57 63.4,12.07 63.4,11.54 C60.2
N$15  (via drill 0.15 pad 0.41)
  Top 0.152: U$10.N8 58.4,11.65 v58.37,11.62
  Route15 0.254: v58.37,11.62 58.37,11.31 56.39,9.33 46.86,9.33 40.49,15.7 40.49,25.15 SPI_CS+.1
N$16  (via drill 0.15 pad 0.41)
  Top 0.152: U$10.M15 U$10.N15 61.9,12.71 61.42,12.23 61.42,11.94 C58.2 61.04,9.64 60.88,9.48 57.5,9.48 C57.2 55.42,12.83 U$10.N2 U$10.N3 U$10.N4 U$10.N5
  Top 0.254: INTAN.3 INTAN.4 | U$10.N4 56.4,11.7 v56.39,11.69
  Route15 0.254: v56.39,11.69 56.39,10.55 55.7,9.86 48.46,9.86 41.68,16.64 41.68,28.91 44.2,31.43 57.26,31.43 INTAN.4
N$17
  Top 0.254: K28.2 29.05,47.79 30.68,47.79 30.94,48.04 | 30.94,48.04 31.09,48.2 K27.3 | DELC1.7 59.42,46.09 SPI1.7 54.97,47.33 33.81,47.33 33.09,48.04 30.94,48.04
N$18  (via drill 0.15 pad 0.41)
  Top 0.254: K29.1 32.94,56.02 v34.01,56.02
  Route15 0.254: v34.01,56.02 51.92,56.02 DELC1.8
  Bottom 0.254: DELC1.8 DELC1.6 DELC1.4 DELC1.2
N$19
  Top 0.254: K27.6 K27.5 30.59,44.9 32.54,42.96 61.85,42.96 63.3,44.41 63.3,47.42 DELC1.5
N$20  (via drill 0.15 pad 0.41)
  Top 0.152: U$10.N10 59.4,11.73 v59.28,11.62
  Bottom 0.152: SPI1.5 48.92,41.33 48.92,37.37 42.37,30.82 42.37,15.58 48.62,9.33 57,9.33 v59.28,11.62
N$21
  Top 0.254: DELC1.3 65.38,50.17 33.34,50.17 K27.1 K27.2
N$22  (via drill 0.15 pad 0.41)
  Top 0.254: v32.13,47.56 31.59,47.02 K27.7
  Bottom 0.254: DELC1.1 66.75,51.34 48.51,51.49 44.73,47.71 v32.13,47.56
N$23  (via drill 0.15 pad 0.41)
  Top 0.152: U$10.N14 61.35,12.85 60.58,12.07 60.43,12.07 60.2,11.84 60.2,10.93 v59.66,10.4
  Bottom 0.152: v59.66,10.4 59.59,10.4 57.3,8.11 48.23,8.11 41.07,15.27 41.07,32.04 42.44,33.41 42.44,35.85 47.55,40.95 47.55,45.04 SPI1.1
N$24  (via drill 0.15 pad 0.41)
  Top 0.152: U$10.N12 60.4,12.66 59.89,12.15 59.89,11.54 v58.75,10.4
  Bottom 0.152: v58.75,10.4 57.07,8.72 48.92,8.72 48.46,8.72 41.76,15.43 41.76,31.12 48.31,37.68 48.31,43.26 SPI1.3
N$25
  Top 0.254: R67.2 K23.3
N$26
  Top 0.102: U$10.J1 53.65,14.85 51.51,12.71 48.39,12.71 46.73,11.06 46.73,10.91 46.68,10.85 45.77,10.85
  Top 0.152: 45.77,10.85 U$4.P$31
N$27
  Top 0.102: U$10.J2 55.16,14.61 54.1,14.61 51.51,12.02 49.88,12.02 49.83,12.07
  Top 0.152: 49.83,12.07 U$4.P$30
N$28
  Top 0.102: U$4.P$29 46.58,12.1 48.41,13.93 51.38,13.93 52.8,15.35 U$10.H1
N$29
  Top 0.102: U$10.H2 55.4,15.33 55.17,15.1 53.21,15.1 51.46,13.34 49.83,13.34 U$4.P$28
N$30
  Top 0.102: U$4.P$27 46.53,13.37 48.44,15.27 51.33,15.27 51.91,15.85 52.95,15.85 53.03,15.85 U$10.G1
N$31
  Top 0.102: U$10.G2 55.13,15.58 52.27,15.58 51.33,14.64 U$4.P$26
N$32
  Top 0.102: U$4.P$25 46.38,15.27 47.09,15.27 48.26,16.44 54.81,16.44 U$10.F1
N$33
  Top 0.102: U$10.F2 55.16,16.11 50.01,16.11 U$4.P$24
N$34
  Top 0.102: U$10.E1 51.99,16.85 51.81,16.67 46.51,16.67 U$4.P$23
N$35
  Top 0.102: U$10.E2 55.15,17.1 49.88,17.1
  Top 0.152: 49.88,17.1 U$4.P$22
N$36
  Top 0.102: U$10.D1 53.6,17.35 53.15,17.8 46.37,17.8 U$4.P$21
N$37
  Top 0.102: U$4.P$20 52.93,18.45 53.8,17.58 54.99,17.58 55.22,17.35 U$10.D2
N$38
  Top 0.102: U$4.P$19 46.35,19.06 52.96,19.06 54.17,17.85 U$10.C1
N$39
  Top 0.102: U$10.C2 55.22,17.85 54.99,18.08 54.45,18.08 52.81,19.72 49.86,19.72 49.83,19.69
  Top 0.152: 49.83,19.69 U$4.P$18
N$40
  Top 0.102: U$4.P$17 46.38,20.35 52.9,20.35 U$10.B1
N$41
  Top 0.102: U$10.A1 52.76,20.99 U$4.P$16
N$42
  Top 0.102: U$4.P$15 46.25,21.5 53.03,21.5 55.17,19.36 55.17,18.75 55.4,18.53 U$10.B2
N$43
  Top 0.102: U$4.P$14 53.09,22.26 55.4,19.94 U$10.A2
N$44
  Top 0.102: U$4.P$13 46.33,22.84 53.34,22.84 55.67,20.51 55.67,18.75 55.9,18.53 U$10.B3
N$45
  Top 0.102: U$10.A3 55.9,21.02 53.41,23.5 49.83,23.5
  Top 0.152: 49.83,23.5 U$4.P$12
N$46  (via drill 0.15 pad 0.41)
  Top 0.254: PWR.3 PWR.4 46.51,37.53 v46.51,41.05 | v19.73,61.27 19.28,60.82 R5.2
  Route2 0.254: v26.29,61.27 v19.73,61.27
  Route15 0.254: v46.51,41.05 v26.29,61.27
N$47
  Top 0.102: U$4.P$11 46.25,24.04 53.72,24.04 56.15,21.61 56.15,18.78 56.4,18.53 U$10.B4
N$48
  Top 0.102: U$10.A4 56.36,18.89 56.36,22.03 53.59,24.8 U$4.P$10
N$49
  Top 0.102: U$4.P$9 46.3,25.36 53.82,25.36 56.65,22.53 56.65,18.78 56.9,18.53 U$10.B5
N$50
  Top 0.102: U$10.A5 56.9,23.07 53.9,26.07 U$4.P$8
N$51
  Top 0.102: U$4.P$7 46.41,26.73 54.1,26.73 57.17,23.66 57.17,18.75 57.35,18.58 57.35,18.35
  Top 0.152: 57.35,18.35 U$10.B6
N$52
  Top 0.102: U$10.A6 57.4,24.27 54.3,27.36 49.83,27.36 U$4.P$6
N$53
  Top 0.102: U$4.P$5 46.46,28.05 54.51,28.05 57.67,24.88 57.67,18.75 57.9,18.53 U$10.B7
N$54
  Top 0.102: U$10.A7 57.9,25.55 54.85,28.6 49.82,28.6
  Top 0.152: 49.82,28.6 U$4.P$4
N$55
  Top 0.102: U$4.P$3 47.14,28.61 47.75,29.22 55.04,29.22 58.17,26.09 58.17,18.75 58.4,18.53 U$10.B8
N$56
  Top 0.102: U$10.A8 58.4,26.93 55.42,29.9 49.83,29.9
  Top 0.152: 49.83,29.9 U$4.P$2
N$57
  Top 0.102: U$10.B9 58.65,18.6 58.65,27.64 55.45,30.84 46.71,30.84 U$4.P$1
N$58
  Top 0.102: U$10.A9 58.9,21.95 61.75,24.8 U$3.P$32
N$59
  Top 0.102: U$3.P$31 75.18,24.27 61.9,24.27 59.4,21.77 U$10.A10
N$60
  Top 0.102: U$10.B10 59.4,18.53 59.63,18.75 59.63,21.23 62.05,23.66 71.53,23.66 71.63,23.55
  Top 0.152: 71.63,23.55 U$3.P$30
N$61
  Top 0.102: U$3.P$29 75.13,22.94 61.92,22.94 59.9,20.92 U$10.A11
N$62
  Top 0.102: U$10.B11 59.9,18.53 60.13,18.75 60.13,20.46 61.95,22.28 71.53,22.28 71.6,22.21
  Top 0.152: 71.6,22.21 U$3.P$28
N$63
  Top 0.102: U$10.A12 60.4,20.15 61.9,21.65 75.11,21.65 U$3.P$27
N$64
  Top 0.102: U$10.B12 60.4,18.53 60.63,18.75 60.63,19.72 62.05,21.14 71.5,21.14 U$3.P$26
N$65
  Top 0.102: U$10.A13 60.9,19.41 61.85,20.35 75.08,20.35 U$3.P$25
N$66
  Top 0.102: U$3.P$24 71.42,19.95 61.95,19.95 61.13,19.12 61.13,18.75 60.9,18.53 U$10.B13
N$67
  Top 0.102: U$10.A14 62.19,19.64 69.47,19.64 70.05,19.06 75.06,19.06 U$3.P$23
N$68
  Top 0.102: U$10.B14 61.58,18.35 61.81,18.58 62.99,18.58 63.12,18.45 U$3.P$22
N$69  (via drill 0.1 pad 0.2)
  Top 0.102: U$10.A15 62.34,19.29 v63.6,19.29 | v73.76,18.45 75.67,18.45 75.69,18.47
  Top 0.152: 75.69,18.47 U$3.P$21
  Bottom 0.102: v63.6,19.29 72.92,19.29 v73.76,18.45
N$70  (via drill 0.1 pad 0.2)
  Top 0.102: U$10.B15 61.9,17.71 62,17.61 v62.13,17.61 | v69.87,17.18 U$3.P$20
  Route15 0.102: v62.13,17.61 69.44,17.61 v69.87,17.18
N$71  (via drill 0.1 pad 0.2)
  Top 0.102: U$10.A16 62.58,18.85 62.81,19.08 62.99,19.08 63.09,18.98 v64.9,18.98 | v73.84,17.2 75.69,17.2 U$3.P$19
  Bottom 0.102: v64.9,18.98 72.06,18.98 v73.84,17.2
N$72
  Top 0.102: U$10.B16 62.58,18.35 62.81,18.12 62.99,18.12 63.35,17.76 68.33,17.76 70.18,15.91 U$3.P$18
N$73  (via drill 0.1 pad 0.2)
  Top 0.102: U$10.A17 63.01,18.85 63.18,18.68 v66.67,18.68 | v73.86,15.96 75.67,15.96 U$3.P$17
  Bottom 0.102: v66.67,18.68 71.14,18.68 v73.86,15.96
N$74  (via drill 0.1 pad 0.2)
  Top 0.102: U$10.B17 62.98,18.35 63.26,18.07 v67.59,18.07 | v69.75,14.97 71.32,14.97
  Top 0.127: 71.32,14.97 U$3.P$16
  Bottom 0.102: v67.59,18.07 68.5,18.07 69.04,17.53 69.04,15.68 v69.75,14.97
N$75  (via drill 0.1 pad 0.2)
  Top 0.102: U$10.C16 62.67,17.58 62.99,17.58 63.29,17.28 v63.68,17.28 | v73.79,14.56 75.59,14.56 75.69,14.66
  Top 0.152: 75.69,14.66 U$3.P$15
  Route15 0.102: v63.68,17.28 68.35,17.28 71.07,14.56 v73.79,14.56
N$76
  Top 0.102: U$10.C17 63.05,17.85 63.36,17.53 65.94,17.53 70.1,13.37 U$3.P$14
N$77  (via drill 0.1 pad 0.15, 0.1 pad 0.2)
  Top 0.102: U$10.D16 62.45,17.35 62.45,17.36 v62.62,17.2 | v73.99,13.37 U$3.P$13
  Bottom 0.102: v62.62,17.2 62.76,17.05 66.65,17.05 70.33,13.37 v73.99,13.37
N$78
  Top 0.102: U$10.D17 63.01,17.35 63.3,17.05 65.12,17.05 70.08,12.1 U$3.P$12
N$79  (via drill 0.1 pad 0.15, 0.1 pad 0.2)
  Top 0.102: U$10.E16 v62.65,16.6 v62.66,16.6 | v73.99,12.07 75.69,12.07
  Top 0.152: 75.69,12.07 U$3.P$11
  Bottom 0.102: v62.66,16.6 66.09,16.6 70.61,12.07 v73.99,12.07
N$80
  Top 0.102: U$10.E17 64.08,16.85 70.1,10.83 U$3.P$10
N$81  (via drill 0.1 pad 0.15, 0.1 pad 0.2)
  Top 0.102: U$10.F16 62.44,16.35 v62.69,16.1 v62.7,16.09 | v73.94,10.83 75.61,10.83 75.67,10.78
  Top 0.152: 75.67,10.78 U$3.P$9
  Bottom 0.102: v62.7,16.09 65.57,16.1 70.84,10.83 v73.94,10.83
N$82
  Top 0.102: U$10.F17 64.05,16.35 70.84,9.56 U$3.P$8
N$83  (via drill 0.1 pad 0.15, 0.1 pad 0.2)
  Top 0.102: U$10.G16 62.4,15.8 62.6,15.6 v62.62,15.58 | v73.94,9.56 U$3.P$7
  Bottom 0.102: v62.62,15.58 64.9,15.6 70.94,9.56 v73.94,9.56
N$84
  Top 0.102: U$3.P$6 70.76,8.29 64.54,14.51 64.54,15.25 63.94,15.85 U$10.G17
N$85  (via drill 0.1 pad 0.15, 0.1 pad 0.2)
  Top 0.102: U$10.H16 v62.64,15.11 v62.64,15.1 | v73.96,8.26 75.69,8.26 U$3.P$5
  Bottom 0.102: v62.64,15.1 64.28,15.1 71.12,8.26 v73.96,8.26
N$86
  Top 0.102: U$10.H17 69.7,8.55 69.7,8.24 70.89,7.04 71.63,7.04
  Top 0.152: 71.63,7.04 U$3.P$4
N$87  (via drill 0.1 pad 0.15, 0.1 pad 0.2)
  Top 0.102: U$10.J16 v62.64,14.61 v62.64,14.6 | v74.02,7.02 75.61,7.02 75.67,6.97
  Top 0.152: 75.67,6.97 U$3.P$3
  Bottom 0.102: v62.64,14.6 64.02,14.6 71.6,7.02 v74.02,7.02
N$88
  Top 0.102: U$10.J17 69.37,8.38 69.37,7.04 70.66,5.75 U$3.P$2
N$89  (via drill 0.1 pad 0.15, 0.1 pad 0.2)
  Top 0.102: U$10.K16 v62.65,14.1 v62.64,14.11 | v74.09,5.77 75.69,5.77 U$3.P$1
  Bottom 0.102: v62.64,14.11 63.35,14.1 71.68,5.77 v74.09,5.77
N$90
  Top 0.305: U1.3 10.86,23.21 C47.2
N$91  (via drill 0.15 pad 0.41)
  Top 0.254: U2.A5 v19.63,55.3
  Bottom 0.254: JTAG1.3 52.3,64.85 45.19,64.85 41.07,60.74 34.77,60.74 29.87,55.84 20.17,55.84 v19.63,55.3
N$92  (via drill 0.15 pad 0.41)
  Top 0.254: U2.A6 20.19,52.7 20.19,54.51 20.6,55 v20.8,55.28
  Bottom 0.254: JTAG1.9 44.12,59.65 34.92,59.65 30.48,55.2 v20.8,55.28
N$93  (via drill 0.15 pad 0.41)
  Top 0.254: U2.A7 21.44,53.45 v24.79,53.45
  Bottom 0.254: JTAG1.1 57.16,62.05 55.88,60.77 55.88,57.41 51.92,53.45 v24.79,53.45
N$94  (via drill 0.15 pad 0.41)
  Top 0.254: v18.64,54.77 19.13,54.28 U2.A4
  Bottom 0.254: JTAG1.8 44.32,54.77 v18.64,54.77
N$95  (via drill 0.15 pad 0.41)
  Top 0.254: U2.A8 21.15,52.66 v23.55,52.66
  Bottom 0.254: JTAG1.5 50.88,61.33 50.88,57.92 47.19,54.24 24.43,54.24 23.55,53.35 v23.55,52.66
N$96
  Top 0.254: K15.4 C52.2 16.53,8.84 C14.1 15.23,9 12.06,9 11.59,9.48 D9.1
N$97
  Top 0.102: U$10.M1 53.77,12.22 53.77,6.54 55.19,5.11 58.22,5.11 59.44,3.89 REF1.2
N$98
  Top 0.254: U$6.B R7.1
N$99  (via drill 0.15 pad 0.41)
  Top 0.254: USB1.2 66.89,62.1 R10.1 | U2.B8 24.03,52.14 v24.11,52.22
  Bottom 0.254: USB1.2 66.89,55.83 63.85,52.79 24.68,52.79 v24.11,52.22
N$100  (via drill 0.1 pad 0.15, 0.15 pad 0.41)
  Top 0.102: U2.E5 19.64,50.64 v19.89,50.4
  Top 0.254: R6.1 USB1.3 64.34,59.48 64.34,54.8 60.58,51.04 v41.73,51.04
  Bottom 0.102: v41.73,51.04 23.55,51.04 22.91,50.4 v19.89,50.4
N$101  (via drill 0.15 pad 0.41)
  Top 0.254: USB1.1 R11.1 | v23.57,51.65 v23.57,51.64 U2.C8
  Bottom 0.254: v23.57,51.65 37.06,51.65 37.41,52 65.1,52 69.43,56.34 USB1.1
N$102
  Top 0.254: R8.1 U$6.G
N$103
  Top 0.254: R9.1 6.31,52.34 U$6.R
N$104  (via drill 0.15 pad 0.41)
  Top 0.152: U2.G8 23.06,49.64 v23.32,49.39
  Route2 0.152: v23.32,49.39 34.7,38.01 GPIO.2
N$105  (via drill 0.15 pad 0.41)
  Top 0.152: U2.F8 23.26,50.14 v23.32,50.2
  Route2 0.152: v23.32,50.2 23.72,49.79 24.33,49.79 33.04,41.09 44.83,41.09 45.37,40.55 GPIO.1
N$106  (via drill 0.15 pad 0.41)
  Top 0.254: v31.77,52.33 31.67,52.43 31.67,54.51 K29.4
  Route15 0.254: SPI_CS+.2 38.78,33.56 39.79,34.56 39.79,44.32 v31.77,52.33
N$128  (via drill 0.15 pad 0.41)
  Top 0.254: D10.2 11.56,11.65 11.56,12.5 v11.53,12.5 | U1.2 13.59,24.16 U1.4 | U1.4 15.86,23.21 C51.2 | U1.4 13.35,23.21 v13.18,23.05
  Bottom 0.254: v11.53,12.5 11.53,13.09 12.24,13.8 12.24,22.11 v13.18,23.05
N$138
  Top 0.254: U1.5 14.55,25.12 14.55,26.63 14.1,27.09 11.35,27.09 10.8,26.53 C47.1 10.21,23.66 8.7,22.14 R57.1 6.42,19.23 C18.1
N$139
  Top 0.254: U2.A1 17.62,52.66 15.32,52.66 14.73,53.25 X3.1 C65.1
N$143  (via drill 0.1 pad 0.15, 0.15 pad 0.41)
  Top 0.102: U2.D2 18.16,51.12 18.18,51.12 v18.4,50.9 | U2.H1 v17.88,49.39 | U2.E4 19.13,50.67 v18.9,50.91 | U2.E6 v19.89,50.88
  Top 0.254: C8.2 17.02,45.78 C9.2 C7.2 17.02,48.53 U2.H1 | C8.2 17.98,45.65 C13.2 | v17.07,44.87 17.02,44.91 C8.2
  Bottom 0.102: v17.88,49.39 17.88,50.38 v18.4,50.9 18.41,50.91 v18.9,50.91 18.92,50.88 v19.89,50.88
  Bottom 0.254: MCU.4 MCU.3 40.18,40.2 39.24,39.26 22.68,39.26 v17.07,44.87
N$161
  Top 0.254: Q2.2 17.34,13.9 18.03,13.9 18.46,13.47 R50.1 18.61,13.5 R51.2
N$163  (via drill 0.15 pad 0.41)
  Top 0.254: K17.1 v13.38,18.68 | v9.63,16.8 v9.62,16.8 K16.1
  Route2 0.254: v13.38,18.68 11.5,16.8 v9.63,16.8
N$164
  Top 0.254: K17.2 13.79,18.17 13.59,17.97 13.59,16.57 12.53,15.52 K16.7
N$168  (via drill 0.15 pad 0.41)
  Top 0.254: D8.2 12.67,11.64 v12.67,12.38
  Bottom 0.254: v12.67,12.38 12.67,20.45 13.64,21.42 13.64,30.67 16.56,33.59 JP4.4 JP4.3
N$175
  Top 0.254: K23.5 R65.2 9.43,43.82 R66.1
N$177
  Top 0.254: U2.C1 12.83,51.65 11.1,49.92 X4.1 9.8,48 C63.1
N$178
  Top 0.254: U2.B1 17.58,52.05 13.58,52.05 12.53,53.25 X3.2 9.87,55.02 C64.1
N$180
  Top 0.254: C62.1 13.79,49.91 X4.2 14.12,49.92 15.34,51.14 17.63,51.14 U2.D1
N$208
  Top 0.254: K28.1 28.64,47.25 27.61,47.25 26.28,48.58 K28.4 27.49,50.02 32.54,50.02 33.4,50.88 33.86,50.88 35.64,52.66 35.64,56.27 34.98,56.93 33.04,56.93 32.04,55.92 K29.2
RXCAN  (via drill 0.1 pad 0.15, 0.15 pad 0.41)
  Top 0.102: U2.B3 18.65,52.14 v18.9,51.9
  Top 0.254: K18.4 RXCAN.P$1
  Route15 0.102: v18.9,51.9 19.56,51.24 19.96,51.24 20.68,50.53 v20.68,32.01
  Bottom 0.102: v20.68,32.01 23.9,28.79 32.74,28.79 38.88,22.65 RXCAN.P$1
RXUART  (via drill 0.1 pad 0.15, 0.1 pad 0.2)
  Top 0.102: U2.B7 v20.88,51.9 v20.88,51.89 | v41.38,50.66 72.62,50.66 UART.1
  Route15 0.102: v20.88,51.89 22.51,51.89 23.75,50.66 v23.93,50.66
  Bottom 0.102: v23.93,50.66 v41.38,50.66
TXCAN  (via drill 0.15 pad 0.41)
  Top 0.254: TXCAN.P$1 27.8,13.35 R58.1 27.74,13.31 K19.2 26.15,13.45 24.82,13.45 24.28,13.98 v24.28,18.4 | U2.A3 18.63,53.91 v17.2,55.76
  Route15 0.254: v17.2,55.76 15.77,55.76 15.32,54.8 15.51,27.42 24.28,18.65 v24.28,18.4
TXCANBUS
  Top 0.254: R51.1 20.62,13.31 K19.7
TXUART  (via drill 0.1 pad 0.15, 0.1 pad 0.2)
  Top 0.102: UART.2 73.38,45.96 v72.16,47.18 | v20.37,51.88 20.13,52.11 U2.B6
  Route2 0.102: v72.16,47.18 59.56,47.18 56.54,50.2 v23.95,50.2
  Route15 0.102: v23.95,50.2 22.5,51.65 20.6,51.65 v20.37,51.88
VABD
  Top 0.254: 10.62,14.86 K16.6 12,14.84 13.28,14.84 14.53,13.6 R48.2 14.54,13.44 R47.1 | 10.62,14.86 K16.3 | C46.1 10.62,18.26 10.62,14.86
VIC
  Top 0.254: R3.2 19.57,63.11 K1.3 16.11,65.16 6.27,65.16 4.28,63.17 VIC.P$1 7.99,38.2 12.5,42.71 17.57,42.71 R85.1
VICAIN
  Top 0.254: VICAIN.P$1 13.78,41.87 17.96,41.87 20.16,44.07 R85.2 20.15,44.79 C82.2 20.15,47.63 U2.H3
VIN  (via drill 0.15 pad 0.41)
  Top 0.254: C4.2 14.78,59.24 14.18,59.85 R2.2 15.29,60.74 K1.5 16.36,60.61 v16.36,60.21 | v21.87,46.85 21.87,45.96 R84.1 | R4.1 26.82,58.81 v26.92,58.91
  Route2 0.254: v21.87,46.85 30.91,37.8 VIN.P$1
  Route15 0.254: v21.87,46.85 23.98,46.85 25.88,48.75 25.88,57.87 v26.92,58.91
  Bottom 0.254: v26.92,58.91 25.63,60.21 v16.36,60.21
VIN2  (via drill 0.15 pad 0.41)
  Top 0.254: K15.8 K15.7 22.32,8.8 C10.1 24.35,9.81 v24.41,9.86 | K15.1 18.83,11.44 v19.66,11.44 | K2.1 27.08,56.3 v27.36,56.57
  Route15 0.254: v24.41,9.86 25.42,10.88 25.42,23.35 29.64,27.57 29.64,56.12 29.18,56.57 v27.36,56.57
  Bottom 0.254: v19.66,11.44 21.23,9.86 v24.41,9.86
VINAIN
  Top 0.254: VINAIN.P$1 17.4,39.92 R86.2 21.2,44.71 C83.2 21.25,45.85 R84.2 21.27,47.01 U2.H4
VTN  (via drill 0.15 pad 0.41)
  Top 0.254: K16.5 11.61,14.21 R56.2 9.38,12.22 v8.74,12.86 | R57.2 8.74,18.7 v8.74,18.37
  Bottom 0.254: v8.74,18.37 v8.74,12.86
VTP
  Top 0.254: K16.2 | K16.2 R52.1 7.59,15.48 R53.1

### Text on the board
tPlace: RX | TX | HIVE_DEV_v1 | Chestek Lab